# Altium project MC6205_Altium.PrjPcb (part 1 of 2)
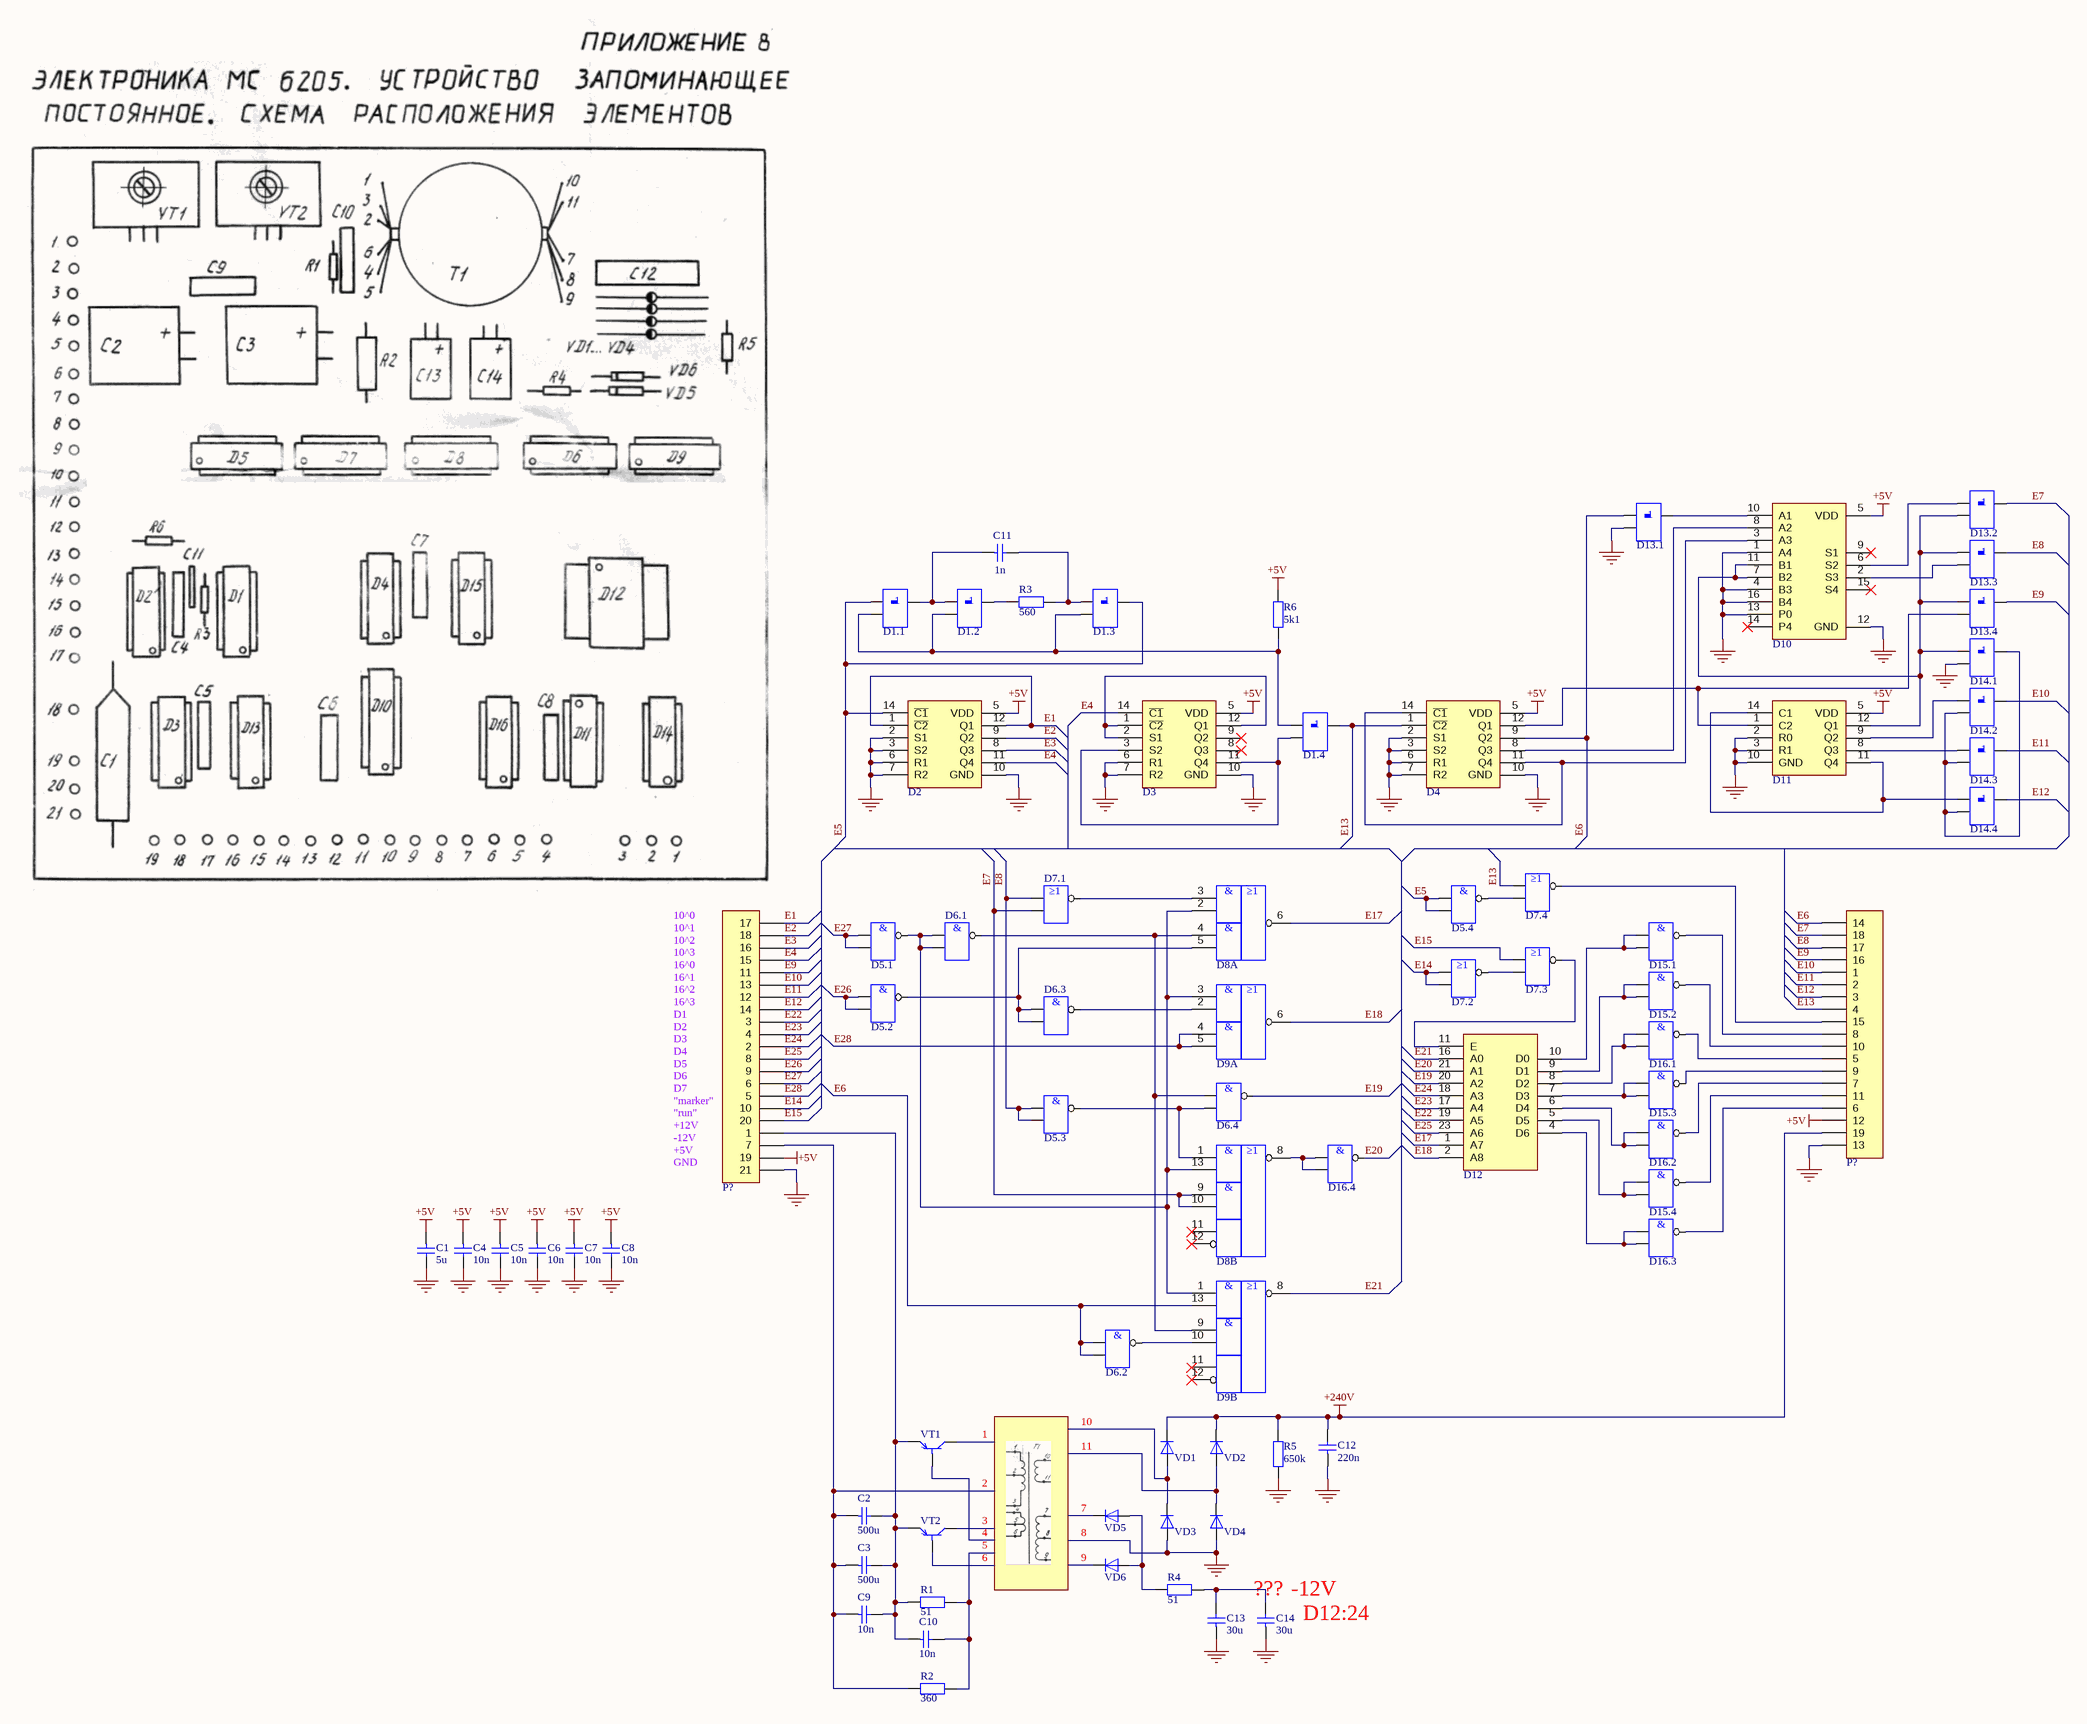
[diagram p0: Permanent_Storage.SchDoc]
4 sheets, 443 parts. Net scope: global (net labels, ports and power ports of the same name join across sheets).
Sheets:
  Permanent_Storage.SchDoc
  Operational_Storage.SchDoc
  Display_Driver.SchDoc
  Cathode_Switch.SchDoc

## Sheet Permanent_Storage.SchDoc
size 594 x 420 mm; SheetNumber: 1; SheetTotal: 4

### Parts
(Parts that share a designator on the sheet are numbered #1, #2 ... from top to bottom, then left to right.)
C1#1  5u
C2#1  500u
C3#1  500u
C4#1  10n
C5#1  10n
C6#1  10n
C7#1  10n
C8  10n
C9  10n
C10  10n
C11  1n
C12  220n
C13  30u
C14  30u
D1.1#1  -  (value not drawn)
D1.2#1  -  (value not drawn)
D1.3#1  -  (value not drawn)
D1.4#1  -  (value not drawn)
D2#1  -  (value not drawn)
D3#1  -  (value not drawn)
D4#1  -  (value not drawn)
D5.1  -  (value not drawn)
D5.2  -  (value not drawn)
D5.3  -  (value not drawn)
D5.4  -  (value not drawn)
D6.1  -  (value not drawn)
D6.2  -  (value not drawn)
D6.3  -  (value not drawn)
D6.4  -  (value not drawn)
D7.1  -  (value not drawn)
D7.2  -  (value not drawn)
D7.3  -  (value not drawn)
D7.4  -  (value not drawn)
D8#1  -  (value not drawn)  (parts A,B of 3)
D9#1  -  (value not drawn)  (parts A,B of 3)
D10#1  -  (value not drawn)
D11#1  -  (value not drawn)
D12#1  -  (value not drawn)
D13.1  -  (value not drawn)
D13.2  -  (value not drawn)
D13.3  -  (value not drawn)
D13.4  -  (value not drawn)
D14.1  -  (value not drawn)
D14.2  -  (value not drawn)
D14.3  -  (value not drawn)
D14.4  -  (value not drawn)
D15.1  -  (value not drawn)
D15.2  -  (value not drawn)
D15.3  -  (value not drawn)
D15.4  -  (value not drawn)
D16.1  -  (value not drawn)
D16.2  -  (value not drawn)
D16.3  -  (value not drawn)
D16.4  -  (value not drawn)
P?#1  -  (value not drawn)
P?#2  -  (value not drawn)
R1#1  51
R2#1  360
R3#1  560
R4#1  51
R5#1  650k
R6#1  5k1
VD1  -  (value not drawn)
VD2  -  (value not drawn)
VD3  -  (value not drawn)
VD4  -  (value not drawn)
VD5  -  (value not drawn)
VD6  -  (value not drawn)
VT1  -  (value not drawn)
VT2  -  (value not drawn)

### Nets
+5V: C1#1.2 C4#1.2 C5#1.2 C6#1.2 C7#1.2 C8.2 D2#1.5(VDD) D3#1.5(VDD) D4#1.5(VDD) D10#1.5(VDD) D11#1.5(VDD) P?#1.19 P?#2.12 R6#1.2
+240V: C12.1 P?#2.19 R5#1.2 VD1.1 VD2.1
GND: C1#1.1 C4#1.1 C5#1.1 C6#1.1 C7#1.1 C8.1 C12.2 C13.2 C14.2 D2#1.2(S1) D2#1.3(S2) D2#1.6(R1) D2#1.7(R2) D2#1.10(GND) D3#1.6(R1) D3#1.7(R2) D3#1.10(GND) D4#1.2(S1) D4#1.3(S2) D4#1.6(R1) D4#1.7(R2) D4#1.10(GND) D10#1.1(A4) D10#1.4(B3) D10#1.12(GND) D10#1.13(P0) D10#1.16(B4) D11#1.2(R0) D11#1.3(R1) D11#1.10(GND) D13.1.3(B1) D14.1.3(B1) P?#1.21 P?#2.13 R5#1.1 VD3.2 VD4.2
E1: D2#1.1(~{C2}) D2#1.12(Q1) P?#1.17
E2: D2#1.9(Q2) P?#1.18
E3: D2#1.8(Q3) P?#1.16
E4: D2#1.11(Q4) D3#1.14(~{C1}) P?#1.15
E5: D1.1#1.2(A1) D1.3#1.1(Y1) D2#1.14(~{C1}) D5.4.1 D5.4.2
E6: D4#1.9(Q2) D6.2.1 D6.2.2 D9#1.13(X6) D13.1.2(A1) P?#2.14
E7: D7.1.2 D8#1.9(X7) D8#1.10(X8) D13.2.1(Y1) P?#2.18
E8: D5.3.1 D5.3.2 D7.1.1 D13.3.1(Y1) P?#2.17
E9: D13.4.1(Y1) P?#1.11 P?#2.16
E10: D14.2.1(Y1) P?#1.13 P?#2.1
E11: D14.3.1(Y1) P?#1.12 P?#2.2
E12: D14.4.1(Y1) P?#1.14 P?#2.3
E13: D1.4#1.1(Y1) D4#1.1(~{C2}) D7.4.1 P?#2.4
E14: D7.2.1 D7.2.2 P?#1.10
E15: D7.3.1 P?#1.20
E17: D8#1.6(Y1) D12#1.1(A7)
E18: D9#1.6(Y1) D12#1.2(A8)
E19: D6.4.3 D12#1.20(A2)
E20: D12#1.21(A1) D16.4.3
E21: D9#1.8(Y2) D12#1.16(A0)
E22: D12#1.19(A5) P?#1.3
E23: D12#1.17(A4) P?#1.4
E24: D12#1.18(A3) P?#1.2
E25: D12#1.23(A6) P?#1.8
E26: D5.2.1 D5.2.2 P?#1.9
E27: D5.1.1 D5.1.2 P?#1.6
E28: D9#1.4(X3) D9#1.5(X4) P?#1.5
NetC2#1_1: C2#1.1 C3#1.1 C9.1 C10.2 P?#1.1 R1#1.1 VT1.2 VT2.2
NetC2#1_2: C2#1.2 C3#1.2 C9.2 P?#1.7 R2#1.1
NetC10_1: C10.1 R1#1.2 R2#1.2
NetC11_1: C11.1 D1.3#1.2(A1) R3#1.2
NetC11_2: C11.2 D1.1#1.1(Y1) D1.2#1.2(A1)
NetC13_1: C13.1 C14.1 R4#1.1
NetD1.1#1_3: D1.1#1.3(B1) D1.2#1.3(B1) D1.3#1.3(B1) D1.4#1.2(A1) R6#1.1
NetD1.2#1_1: D1.2#1.1(Y1) R3#1.1
NetD1.4#1_3: D1.4#1.3(B1) D3#1.3(S2) D3#1.11(Q4)
NetD3#1_1: D3#1.1(~{C2}) D3#1.2(S1) D3#1.12(Q1)
NetD4#1_8: D4#1.8(Q3) D10#1.8(A2)
NetD4#1_11: D4#1.11(Q4) D4#1.14(~{C1}) D10#1.3(A3)
NetD4#1_12: D4#1.12(Q1) D11#1.1(C2) D13.4.3(B1)
NetD5.1_3: D5.1.3 D6.1.1 D6.1.2 D8#1.2(X1) D8#1.13(X6) D9#1.1(X5) D9#1.3(X2)
NetD5.2_3: D5.2.3 D6.3.1 D6.3.2 D8#1.5(X4)
NetD5.3_3: D5.3.3 D6.4.2 D8#1.1(X5)
NetD5.4_3: D5.4.3 D7.4.2
NetD6.1_3: D6.1.3 D6.4.1 D8#1.4(X3) D9#1.9(X7)
NetD6.2_3: D6.2.3 D9#1.10(X8)
NetD6.3_3: D6.3.3 D9#1.2(X1)
NetD7.1_3: D7.1.3 D8#1.3(X2)
NetD7.2_3: D7.2.3 D7.3.2
NetD7.3_3: D7.3.3 D12#1.11(E)
NetD7.4_3: D7.4.3 P?#2.15
NetD8#1_8: D8#1.8(Y2) D16.4.1 D16.4.2
NetD10#1_2: D10#1.2(S3) D13.3.3(B1)
NetD10#1_6: D10#1.6(S2) D13.2.2(A1)
NetD10#1_7: D10#1.7(B2) D10#1.11(B1) D11#1.12(Q1) D13.2.3(B1) D13.3.2(A1) D13.4.2(A1) D14.1.2(A1)
NetD10#1_10: D10#1.10(A1) D13.1.1(Y1)
NetD11#1_8: D11#1.8(Q3) D14.3.2(A1)
NetD11#1_9: D11#1.9(Q2) D14.2.2(A1)
NetD11#1_11: D11#1.11(Q4) D11#1.14(C1) D14.4.2(A1)
NetD12#1_4: D12#1.4(D6) D16.3.1 D16.3.2
NetD12#1_5: D12#1.5(D5) D15.4.1 D15.4.2
NetD12#1_6: D12#1.6(D4) D16.2.1 D16.2.2
NetD12#1_7: D12#1.7(D3) D15.3.1 D15.3.2
NetD12#1_8: D12#1.8(D2) D16.1.1 D16.1.2
NetD12#1_9: D12#1.9(D1) D15.2.1 D15.2.2
NetD12#1_10: D12#1.10(D0) D15.1.1 D15.1.2
NetD14.1_1: D14.1.1(Y1) D14.2.3(B1) D14.3.3(B1) D14.4.3(B1)
NetD15.1_3: D15.1.3 P?#2.8
NetD15.2_3: D15.2.3 P?#2.10
NetD15.3_3: D15.3.3 P?#2.9
NetD15.4_3: D15.4.3 P?#2.11
NetD16.1_3: D16.1.3 P?#2.5
NetD16.2_3: D16.2.3 P?#2.7
NetD16.3_3: D16.3.3 P?#2.6
NetR4#1_2: R4#1.2 VD5.2 VD6.2
NetVD1_2: VD1.2 VD3.1
NetVD2_2: VD2.2 VD4.1

Not connected (* = marked no-connect by the designer): D3#1 8(Q3)* 9(Q2)*; D8#1 11(X9)* 12(X10)*; D9#1 11(X9)* 12(X10)*; D10#1 9(S1)* 14(P4)* 15(S4)*; VD5 1; VD6 1; VT1 1 3; VT2 1 3

### Notes on the sheet
- 10^0
- 10^1
- 16^0
- 16^1
- 16^2
- 10^2
- 10^3
- D1
- D2
- D3
- D4
- 16^3
- D5
- D6
- D7
- (near P?#1) "marker"
- "run"
- GND
- +12V
- -12V
- +5V
- 10
- (near VT1) 1
- 2
- 11
- (near VT2) 3
- (near VT2) 4
- (near VT2) 5
- (near VD5) 7
- 8
- 6
- (near VD6) 9
- (near C14) ???
- (near C14) -12V
- (near C14) D12:24
- DWG NO:
- REV:
- REVISION
- DESCRIPTION
- DATE
- APPROVED
- ENG:
- APPROVALS
- PROJECT
- DSN:
- CHK:
- REFERENCE DOCUMENTS
- PROJECT REVISION:
- TITLE
- DOCUMENT REVISION:
- DESIGN ITEM:
- BOM:
- FAB DWG:
- PCB DWG:
- ASSY DWG:
- SCALE:
- A2
- SIZE
- CAGE CODE
- FILE NAME
- DWG NO.
- SHEET
- OF
- REV
- (in symbol NAND) &
- (in symbol NOR) ≥1
- (in symbol К155ЛР1, part A) &; ≥1
- (in symbol К155ЛР1, part B) &; ≥1

### Library data of the parts
C1#1 C2#1 C3#1 C4#1 C5#1 C6#1 C7#1 C8-C14 = C
D1.1#1 D1.2#1 D1.3#1 D1.4#1 D13.1-D13.4 D14.1-D14.4 = XOR
D2#1 D3#1 D4#1 = К155ИЕ2: four digit decimal counter - https://kiloom.ru/spravochnik-radiodetalej/microsxema/k155ie2-km155ie2.html https://www.microshemca.ru/IE2/
D5.1-D5.4 D6.1-D6.4 D15.1-D15.4 D16.1-D16.4 = NAND
D7.1-D7.4 = NOR
D8#1 D9#1 = К155ЛР1: 2x 2x AND to 1x NOR - https://kiloom.ru/spravochnik-radiodetalej/microsxema/k155lr1-km155lr1-kb155lr1-4.html
D10#1 = К155ИМ3: 4-bit full adder - https://kiloom.ru/spravochnik-radiodetalej/microsxema/k155im3-km155im3.html
D11#1 = К155ИЕ5: binary counter - https://kiloom.ru/spravochnik-radiodetalej/microsxema/k155ie5-km155ie5.html
D12#1 = КР505РЕ3: some sort of ROM
P?#1 = 21x1_Connector_b
P?#2 = 19x1_Connector
R1#1 R2#1 R3#1 R4#1 R5#1 R6#1 = R
VD1-VD6 = D
VT1 VT2 = NPN

## Sheet Operational_Storage.SchDoc
size 594 x 420 mm; SheetNumber: 2; SheetTotal: 4
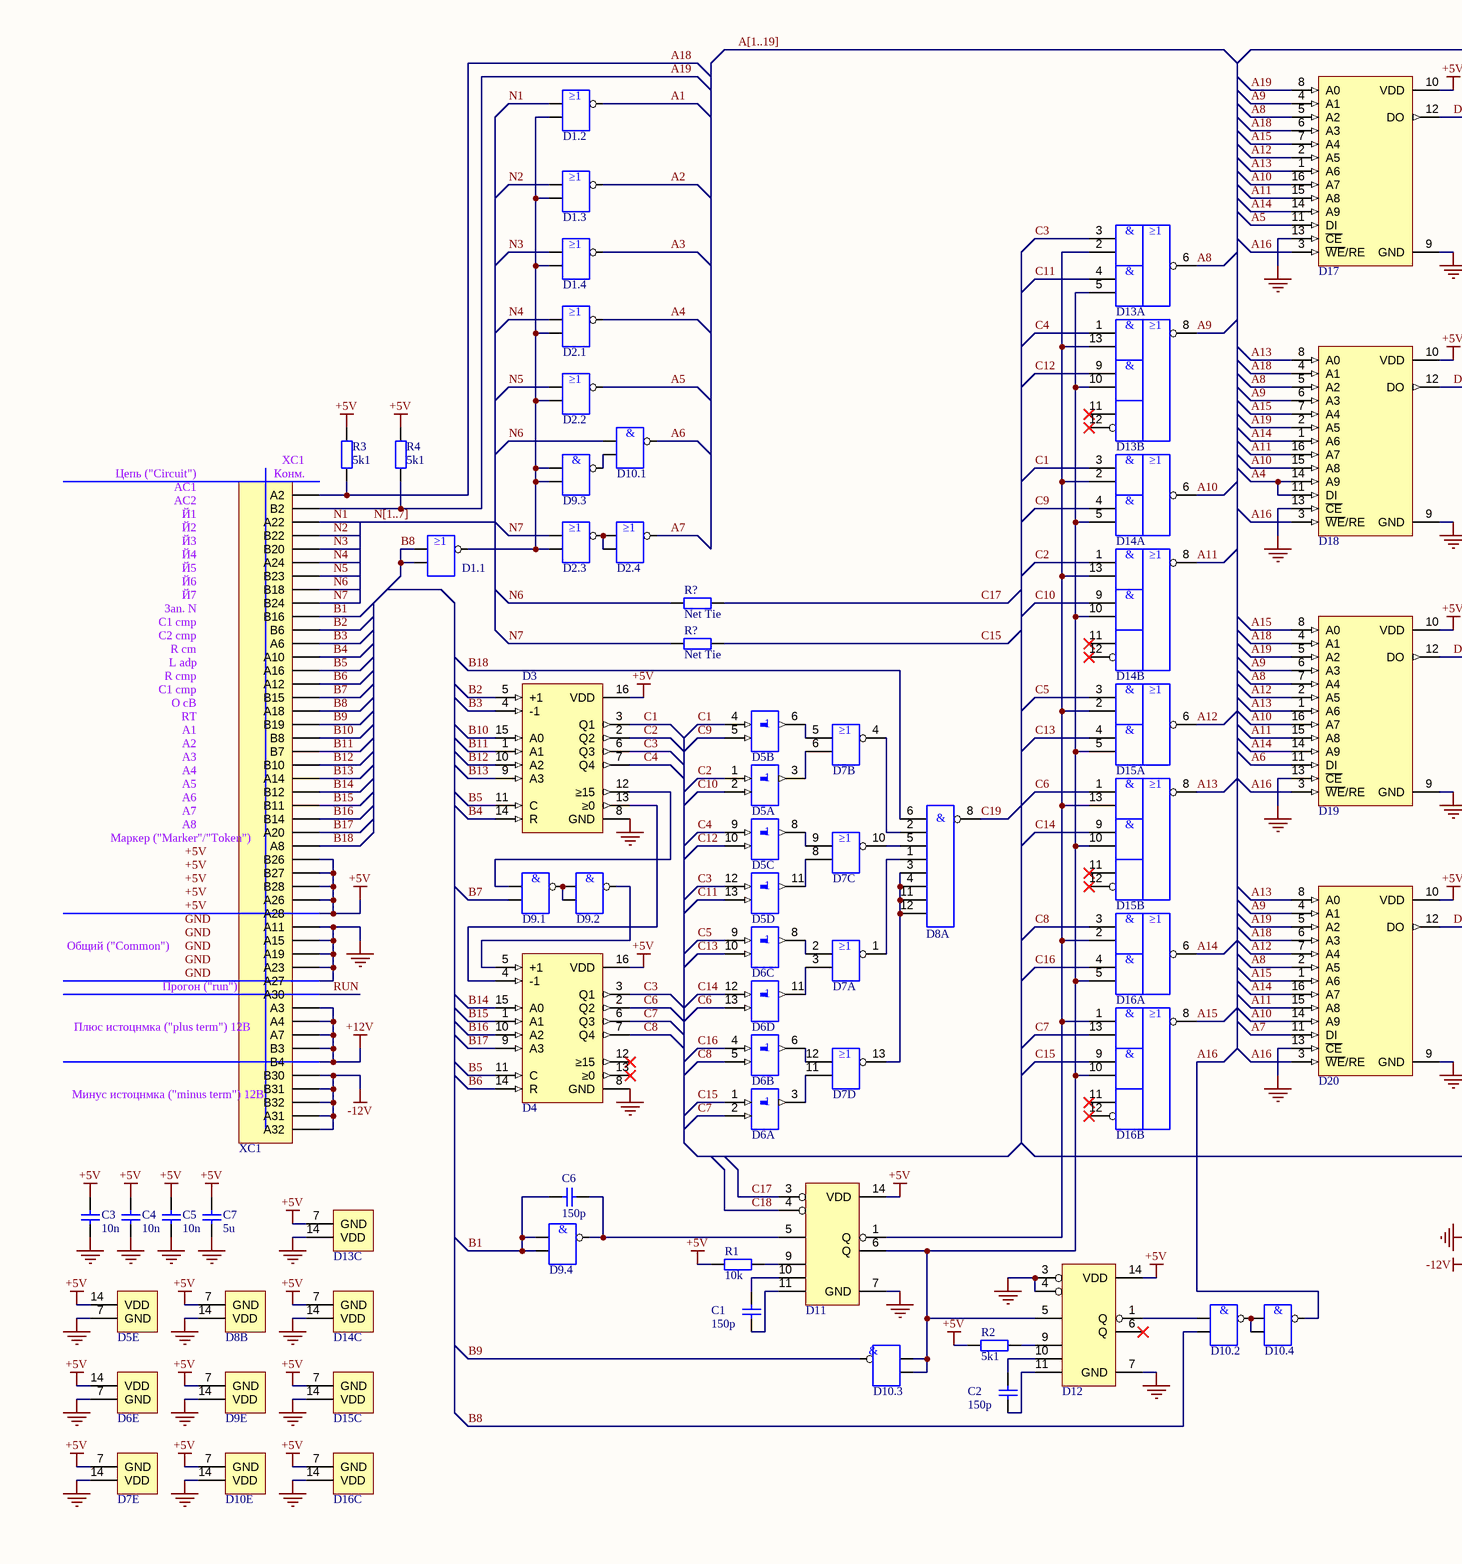
[diagram p1: Operational_Storage.SchDoc, left]
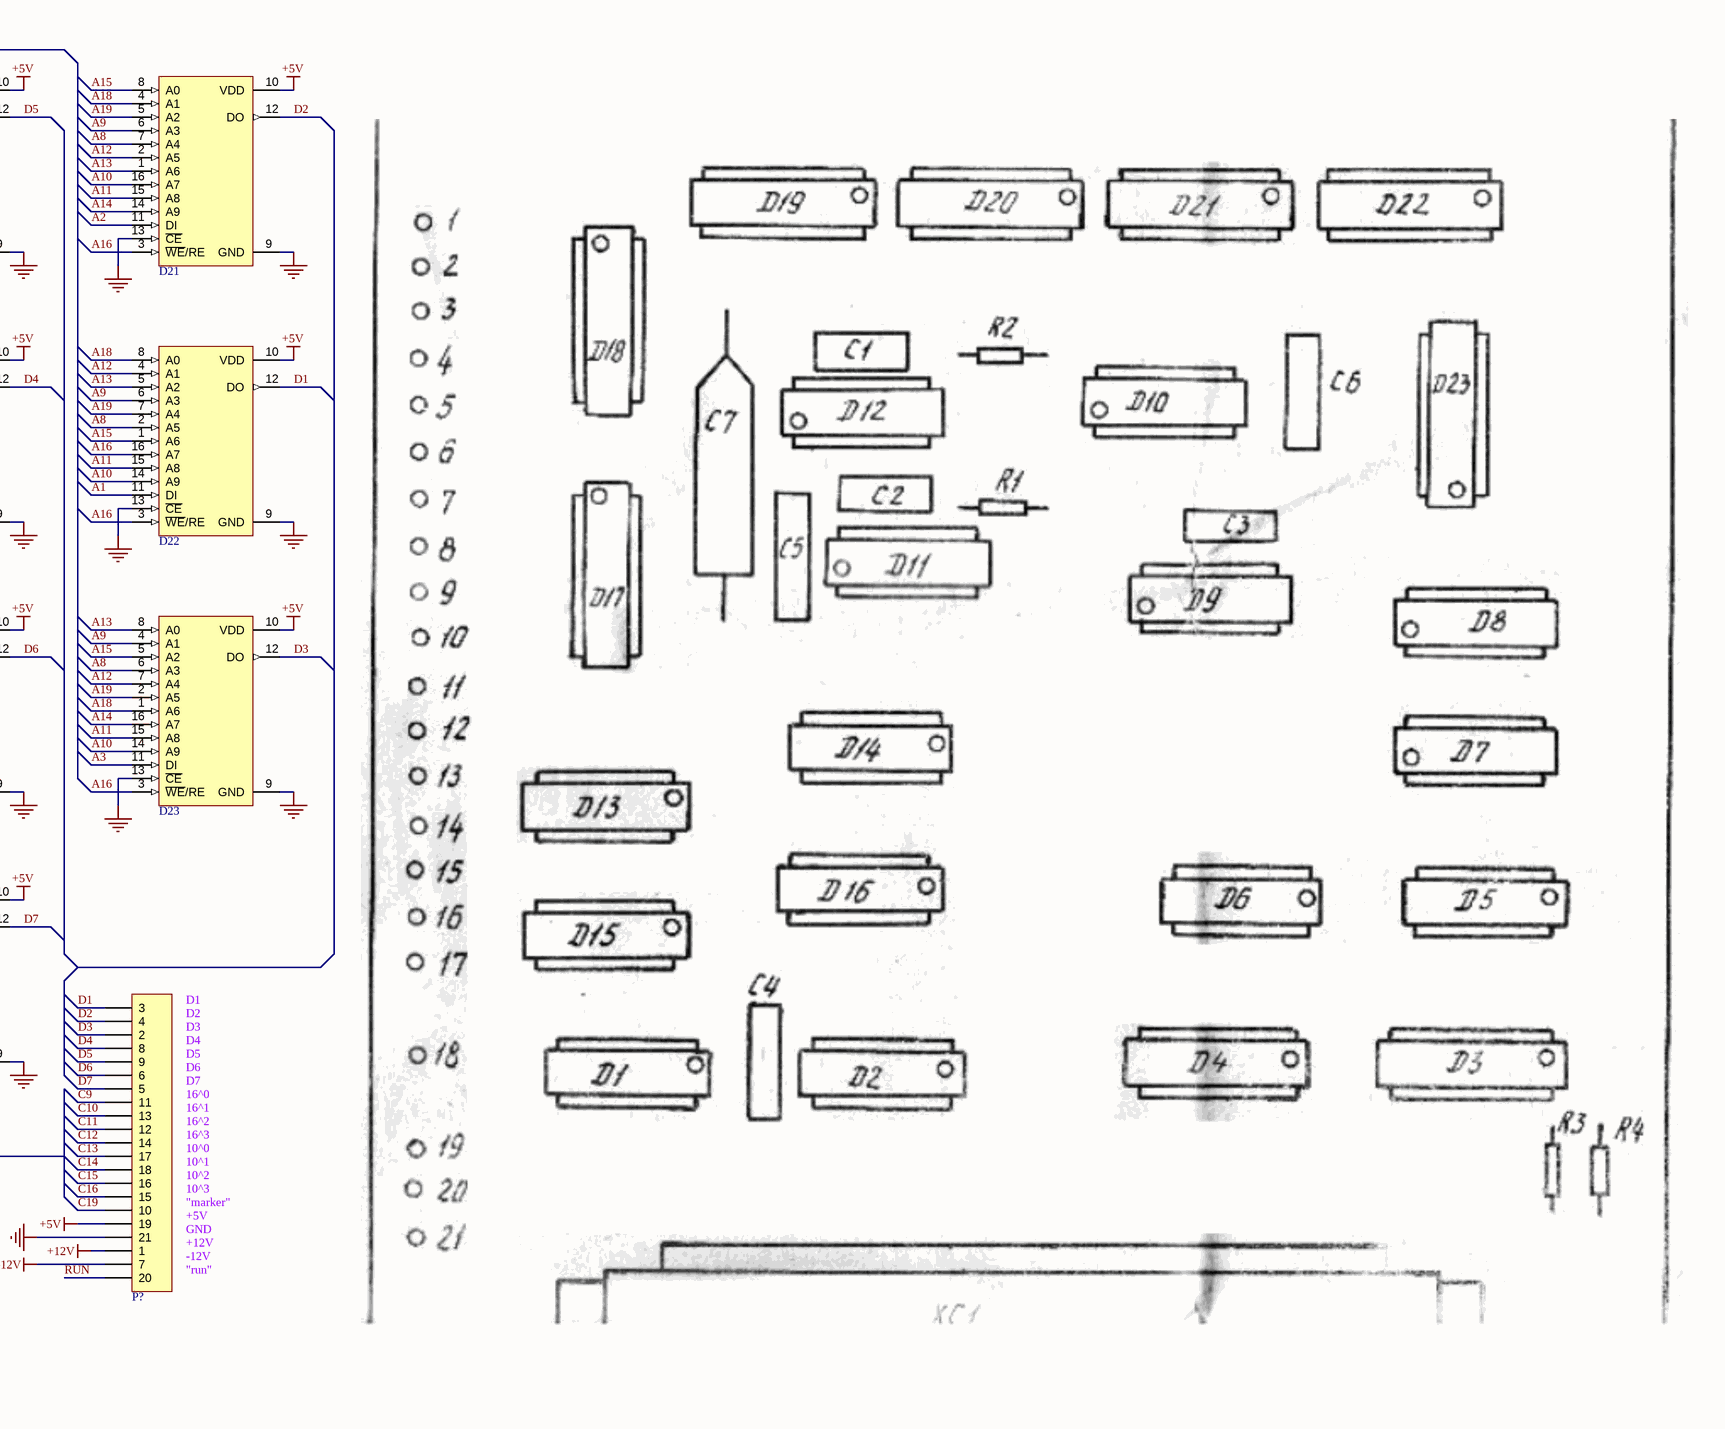
[diagram p2: Operational_Storage.SchDoc, right]

### Parts
(Parts that share a designator on the sheet are numbered #1, #2 ... from top to bottom, then left to right.)
C1#2  150p
C2#2  150p
C3#2  10n
C4#2  10n
C5#2  10n
C6#2  150p
C7#2  5u
D1.1#2  -  (value not drawn)
D1.2#2  -  (value not drawn)
D1.3#2  -  (value not drawn)
D1.4#2  -  (value not drawn)
D2.1#1  -  (value not drawn)
D2.2#1  -  (value not drawn)
D2.3  -  (value not drawn)
D2.4#1  -  (value not drawn)
D3#2  -  (value not drawn)
D4#2  -  (value not drawn)
D5#1  -  (value not drawn)  (parts A,B,C,D,E of 5)
D6#1  -  (value not drawn)  (parts A,B,C,D,E of 5)
D7#1  -  (value not drawn)  (parts A,B,C,D,E of 5)
D8#2  -  (value not drawn)  (parts A,B of 2)
D9#2  -  (value not drawn)  (part E of 5)
D9.1  -  (value not drawn)
D9.2  -  (value not drawn)
D9.3  -  (value not drawn)
D9.4  -  (value not drawn)
D10#2  -  (value not drawn)  (part E of 5)
D10.1  -  (value not drawn)
D10.2  -  (value not drawn)
D10.3  -  (value not drawn)
D10.4  -  (value not drawn)
D11#2  -  (value not drawn)
D12#2  -  (value not drawn)
D13#1  -  (value not drawn)  (parts A,B,C of 3)
D14#1  -  (value not drawn)  (parts A,B,C of 3)
D15#1  -  (value not drawn)  (parts A,B,C of 3)
D16#1  -  (value not drawn)  (parts A,B,C of 3)
D17#1  -  (value not drawn)
D18#1  -  (value not drawn)
D19#1  -  (value not drawn)
D20#1  -  (value not drawn)
D21#1  -  (value not drawn)
D22#1  -  (value not drawn)
D23#1  -  (value not drawn)
P?#3  -  (value not drawn)
R1#2  10k
R2#2  5k1
R3#2  5k1
R4#2  5k1
R?#1  Net Tie
R?#2  Net Tie
XC1  -  (value not drawn)

### Nets
+5V: C3#2.2 C4#2.2 C5#2.2 C7#2.2 D3#2.16(VDD) D4#2.16(VDD) D5#1.14(VDD) D6#1.14(VDD) D7#1.7(GND) D8#2.7(GND) D9#2.7(GND) D10#2.7(GND) D11#2.14(VDD) D12#2.14(VDD) D13#1.7(GND) D14#1.7(GND) D15#1.7(GND) D16#1.7(GND) D17#1.10(VDD) D18#1.10(VDD) D19#1.10(VDD) D20#1.10(VDD) D21#1.10(VDD) D22#1.10(VDD) D23#1.10(VDD) P?#3.19 R1#2.1 R2#2.1 R3#2.2 R4#2.2 XC1.A26 XC1.A28 XC1.B26 XC1.B27 XC1.B28
+12V: P?#3.1 XC1.A3 XC1.A4 XC1.A7 XC1.B3 XC1.B4
-12V: P?#3.7 XC1.A31 XC1.A32 XC1.B30 XC1.B31 XC1.B32
GND: C3#2.1 C4#2.1 C5#2.1 C7#2.1 D3#2.8(GND) D4#2.8(GND) D5#1.7(GND) D6#1.7(GND) D7#1.14(VDD) D8#2.14(VDD) D9#2.14(VDD) D10#2.14(VDD) D11#2.7(GND) D12#2.3(A1) D12#2.4(A2) D12#2.7(GND) D13#1.14(VDD) D14#1.14(VDD) D15#1.14(VDD) D16#1.14(VDD) D17#1.9(GND) D17#1.13(~{CE}) D18#1.9(GND) D18#1.13(~{CE}) D19#1.9(GND) D19#1.13(~{CE}) D20#1.9(GND) D20#1.13(~{CE}) D21#1.9(GND) D21#1.13(~{CE}) D22#1.9(GND) D22#1.13(~{CE}) D23#1.9(GND) D23#1.13(~{CE}) P?#3.21 XC1.A11 XC1.A15 XC1.A19 XC1.A23 XC1.A27
A1: D1.2#2.3 D22#1.11(DI)
A2: D1.3#2.3 D21#1.11(DI)
A3: D1.4#2.3 D23#1.11(DI)
A4: D2.1#1.3 D18#1.11(DI) D18#1.14(A9)
A5: D2.2#1.3 D17#1.11(DI)
A6: D10.1.3 D19#1.11(DI)
A7: D2.4#1.3 D20#1.11(DI)
A8: D13#1.6(Y1) D17#1.5(A2) D18#1.5(A2) D19#1.7(A4) D20#1.2(A5) D21#1.7(A4) D22#1.2(A5) D23#1.6(A3)
A9: D13#1.8(Y2) D17#1.4(A1) D18#1.6(A3) D19#1.6(A3) D20#1.4(A1) D21#1.6(A3) D22#1.6(A3) D23#1.4(A1)
A10: D14#1.6(Y1) D17#1.16(A7) D18#1.15(A8) D19#1.16(A7) D20#1.14(A9) D21#1.16(A7) D22#1.14(A9) D23#1.14(A9)
A11: D14#1.8(Y2) D17#1.15(A8) D18#1.16(A7) D19#1.15(A8) D20#1.15(A8) D21#1.15(A8) D22#1.15(A8) D23#1.15(A8)
A12: D15#1.6(Y1) D17#1.2(A5) D19#1.2(A5) D20#1.7(A4) D21#1.2(A5) D22#1.4(A1) D23#1.7(A4)
A13: D15#1.8(Y2) D17#1.1(A6) D18#1.8(A0) D19#1.1(A6) D20#1.8(A0) D21#1.1(A6) D22#1.5(A2) D23#1.8(A0)
A14: D16#1.6(Y1) D17#1.14(A9) D18#1.1(A6) D19#1.14(A9) D20#1.16(A7) D21#1.14(A9) D23#1.16(A7)
A15: D16#1.8(Y2) D17#1.7(A4) D18#1.7(A4) D19#1.8(A0) D20#1.1(A6) D21#1.8(A0) D22#1.1(A6) D23#1.5(A2)
A16: D10.4.3 D17#1.3(~{WE}/RE) D18#1.3(~{WE}/RE) D19#1.3(~{WE}/RE) D20#1.3(~{WE}/RE) D21#1.3(~{WE}/RE) D22#1.3(~{WE}/RE) D22#1.16(A7) D23#1.3(~{WE}/RE)
A18: D17#1.6(A3) D18#1.4(A1) D19#1.4(A1) D20#1.6(A3) D21#1.4(A1) D22#1.8(A0) D23#1.1(A6) R3#2.1 XC1.A2
A19: D17#1.8(A0) D18#1.2(A5) D19#1.5(A2) D20#1.5(A2) D21#1.5(A2) D22#1.7(A4) D23#1.2(A5) R4#2.1 XC1.B2
B1: C6#2.1 D9.4.1 D9.4.2 XC1.B16
B2: D3#2.5(+1) XC1.B6
B3: D3#2.4(-1) XC1.A6
B4: D3#2.14(R) XC1.A10
B5: D3#2.11(C) D4#2.11(C) XC1.A16
B6: D4#2.14(R) XC1.A12
B7: D9.1.2 XC1.B15
B8: D1.1#2.1 D1.1#2.2 D10.2.2 XC1.A18
B9: D10.3.3 XC1.B19
B10: D3#2.15(A0) XC1.B8
B11: D3#2.1(A1) XC1.B7
B12: D3#2.10(A2) XC1.B10
B13: D3#2.9(A3) XC1.A14
B14: D4#2.15(A0) XC1.B12
B15: D4#2.1(A1) XC1.B11
B16: D4#2.10(A2) XC1.B14
B17: D4#2.9(A3) XC1.A20
B18: D8#2.6(X6) XC1.A8
C1: D3#2.3(Q1) D5#1.4(A2) D14#1.3(X2)
C2: D3#2.2(Q2) D5#1.1(A1) D14#1.1(X5)
C3: D3#2.6(Q3) D4#2.3(Q1) D5#1.12(A4) D13#1.3(X2)
C4: D3#2.7(Q4) D5#1.9(A3) D13#1.1(X5)
C5: D6#1.9(A3) D15#1.3(X2)
C6: D4#2.2(Q2) D6#1.13(B4) D15#1.1(X5)
C7: D4#2.6(Q3) D6#1.2(B1) D16#1.13(X6)
C8: D4#2.7(Q4) D6#1.5(B2) D16#1.3(X2)
C9: D5#1.5(B2) D14#1.4(X3) P?#3.11
C10: D5#1.2(B1) D14#1.9(X7) P?#3.13
C11: D5#1.13(B4) D13#1.4(X3) P?#3.12
C12: D5#1.10(B3) D13#1.9(X7) P?#3.14
C13: D6#1.10(B3) D15#1.4(X3) P?#3.17
C14: D6#1.12(A4) D15#1.9(X7) P?#3.18
C15: D6#1.1(A1) D16#1.9(X7) P?#3.16 R?#2.1
C16: D6#1.4(A2) D16#1.4(X3) P?#3.15
C17: D11#2.3(A1) R?#1.1
C18: D11#2.4(A2)
C19: D8#2.8(Y) P?#3.10
D1: D22#1.12(DO) P?#3.3
D2: D21#1.12(DO) P?#3.4
D3: D23#1.12(DO) P?#3.2
D4: D18#1.12(DO) P?#3.8
D5: D17#1.12(DO) P?#3.9
D6: D19#1.12(DO) P?#3.6
D7: D20#1.12(DO) P?#3.5
N1: D1.2#2.1 XC1.A22
N2: D1.3#2.1 XC1.B22
N3: D1.4#2.1 XC1.B20
N4: D2.1#1.1 XC1.A24
N5: D2.2#1.1 XC1.B23
N6: D10.1.1 R?#1.2 XC1.B18
N7: D2.3.1 R?#2.2 XC1.B24
RUN: P?#3.20 XC1.A30
NetC1#2_1: C1#2.1 D11#2.11(RTCT)
NetC1#2_2: C1#2.2 D11#2.10(CT)
NetC2#2_1: C2#2.1 D12#2.11(RTCT)
NetC2#2_2: C2#2.2 D12#2.10(CT)
NetC6#2_2: C6#2.2 D9.4.3 D11#2.5(B)
NetD1.1#2_3: D1.1#2.3 D1.2#2.2 D1.3#2.2 D1.4#2.2 D2.1#1.2 D2.2#1.2 D2.3.2 D9.3.1 D9.3.2
NetD2.3_3: D2.3.3 D2.4#1.1 D2.4#1.2
NetD3#2_12: D3#2.12(≥15) D9.1.1
NetD3#2_13: D3#2.13(≥0) D4#2.4(-1)
NetD4#2_5: D4#2.5(+1) D9.2.3
NetD5#1_3: D5#1.3(Y1) D7#1.6(B2)
NetD5#1_6: D5#1.6(Y2) D7#1.5(A2)
NetD5#1_8: D5#1.8(Y3) D7#1.9(A3)
NetD5#1_11: D5#1.11(Y4) D7#1.8(B3)
NetD6#1_3: D6#1.3(Y1) D7#1.11(B4)
NetD6#1_6: D6#1.6(Y2) D7#1.12(A4)
NetD6#1_8: D6#1.8(Y3) D7#1.2(A1)
NetD6#1_11: D6#1.11(Y4) D7#1.3(B1)
NetD7#1_1: D7#1.1(Y1) D8#2.1(X1)
NetD7#1_4: D7#1.4(Y2) D8#2.2(X2)
NetD7#1_10: D7#1.10(Y3) D8#2.5(X5)
NetD7#1_13: D7#1.13(Y4) D8#2.3(X3) D8#2.4(X4) D8#2.11(X7) D8#2.12(X8)
NetD9.1_3: D9.1.3 D9.2.1 D9.2.2
NetD9.3_3: D9.3.3 D10.1.2
NetD10.2_1: D10.2.1 D12#2.1(Q)
NetD10.2_3: D10.2.3 D10.4.1 D10.4.2
NetD10.3_1: D10.3.1 D10.3.2 D11#2.6(Q) D12#2.5(B) D13#1.5(X4) D13#1.10(X8) D14#1.5(X4) D14#1.10(X8) D15#1.5(X4) D15#1.10(X8) D16#1.5(X4) D16#1.10(X8)
NetD11#2_1: D11#2.1(Q) D13#1.2(X1) D13#1.13(X6) D14#1.2(X1) D14#1.13(X6) D15#1.2(X1) D15#1.13(X6) D16#1.1(X5) D16#1.2(X1)
NetD11#2_9: D11#2.9(BBH) R1#2.2
NetD12#2_9: D12#2.9(BBH) R2#2.2

Not connected (* = marked no-connect by the designer): D4#2 12(≥15)* 13(≥0)*; D12#2 6(Q)*; D13#1 11(X9)* 12(X10)*; D14#1 11(X9)* 12(X10)*; D15#1 11(X9)* 12(X10)*; D16#1 11(X9)* 12(X10)*

### Buses and harness runs
bus A[1..19]
bus N[1..7]

### Notes on the sheet
- AC1
- AC2
- Цепь ("Circuit")
- XC1
- (near XC1) Конм.
- Й1
- Й2
- Й3
- Й4
- Й5
- 3an. N
- C1 cmp
- C2 cmp
- Й6
- Й7
- R cm
- L adp
- R cmp
- O cB
- RT
- A1
- A2
- A3
- A4
- A5
- A6
- A7
- A8
- (near XC1) Маркер ("Marker"/"Token")
- Общий ("Common")
- Прогон ("run")
- (near XC1) Плюс истоцнмка ("plus term") 12B
- D1
- D2
- D3
- D4
- (near XC1) Минус истоцнмка ("minus term") 12B
- D5
- D6
- D7
- 16^0
- 16^1
- 16^2
- 16^3
- 10^0
- 10^1
- 10^2
- 10^3
- +5V
- GND
- +12V
- "marker"
- "run"
- -12V
- Labels drawn without touching a wire or pin: +5V, GND
- DWG NO:
- REV:
- REVISION
- DESCRIPTION
- DATE
- APPROVED
- ENG:
- APPROVALS
- PROJECT
- DSN:
- CHK:
- REFERENCE DOCUMENTS
- PROJECT REVISION:
- TITLE
- DOCUMENT REVISION:
- DESIGN ITEM:
- BOM:
- FAB DWG:
- PCB DWG:
- ASSY DWG:
- SCALE:
- SIZE
- CAGE CODE
- FILE NAME
- DWG NO.
- SHEET
- OF
- REV
- (in symbol NAND) &
- (in symbol NOR) ≥1
- (in symbol К155ЛА2, part A) &
- (in symbol К155ЛЕ1, part A) ≥1
- (in symbol К155ЛЕ1, part B) ≥1
- (in symbol К155ЛЕ1, part C) ≥1
- (in symbol К155ЛЕ1, part D) ≥1
- (in symbol К155ЛР1, part A) &; ≥1
- (in symbol К155ЛР1, part B) &; ≥1

### Library data of the parts
C1#2 C2#2 C3#2 C4#2 C5#2 C6#2 C7#2 = C
D1.1#2 D1.2#2 D1.3#2 D1.4#2 D2.1#1 D2.2#1 D2.3 D2.4#1 = NOR
D3#2 D4#2 = K155IE7_counter_4bit_up/down: https://kiloom.ru/spravochnik-radiodetalej/microsxema/k155ie7-km155ie7.html
D5#1 D6#1 = К155ЛП5: https://kiloom.ru/spravochnik-radiodetalej/microsxema/k155lp5-km155lp5-kb155lp5-4.html
D7#1 = К155ЛЕ1: 4x 2 NOR - https://kiloom.ru/spravochnik-radiodetalej/microsxema/k155le1-km155le1.html
D8#2 = К155ЛА2: 8 input NOR - https://kiloom.ru/spravochnik-radiodetalej/microsxema/k155la2-km155la2-kb155la2-4.html
D9#2 D10#2 = К155ЛА3: 4x NAND - https://kiloom.ru/spravochnik-radiodetalej/microsxema/k155la3-km155la3-kb155la3-4.html
D9.1-D9.4 D10.1-D10.4 = NAND
D11#2 D12#2 = К155АГ1: Multi-vibrator - https://kiloom.ru/spravochnik-radiodetalej/microsxema/k155ag1.html https://www.microshemca.ru/AG1/
D13#1 D14#1 D15#1 D16#1 = К155ЛР1: as D8#1 on sheet Permanent_Storage
D17#1 D18#1 D19#1 D20#1 D21#1 D22#1 D23#1 = КР565РУ2: https://www.radiomuseum.org/tubes/tube_kr565ru2.html
P?#3 = 21x1_Connector
R1#2 R2#2 R3#2 R4#2 R?#1 R?#2 = R
XC1 = 32x2_Connector

## Sheet Display_Driver.SchDoc
size 594 x 420 mm; SheetNumber: 3; SheetTotal: 4
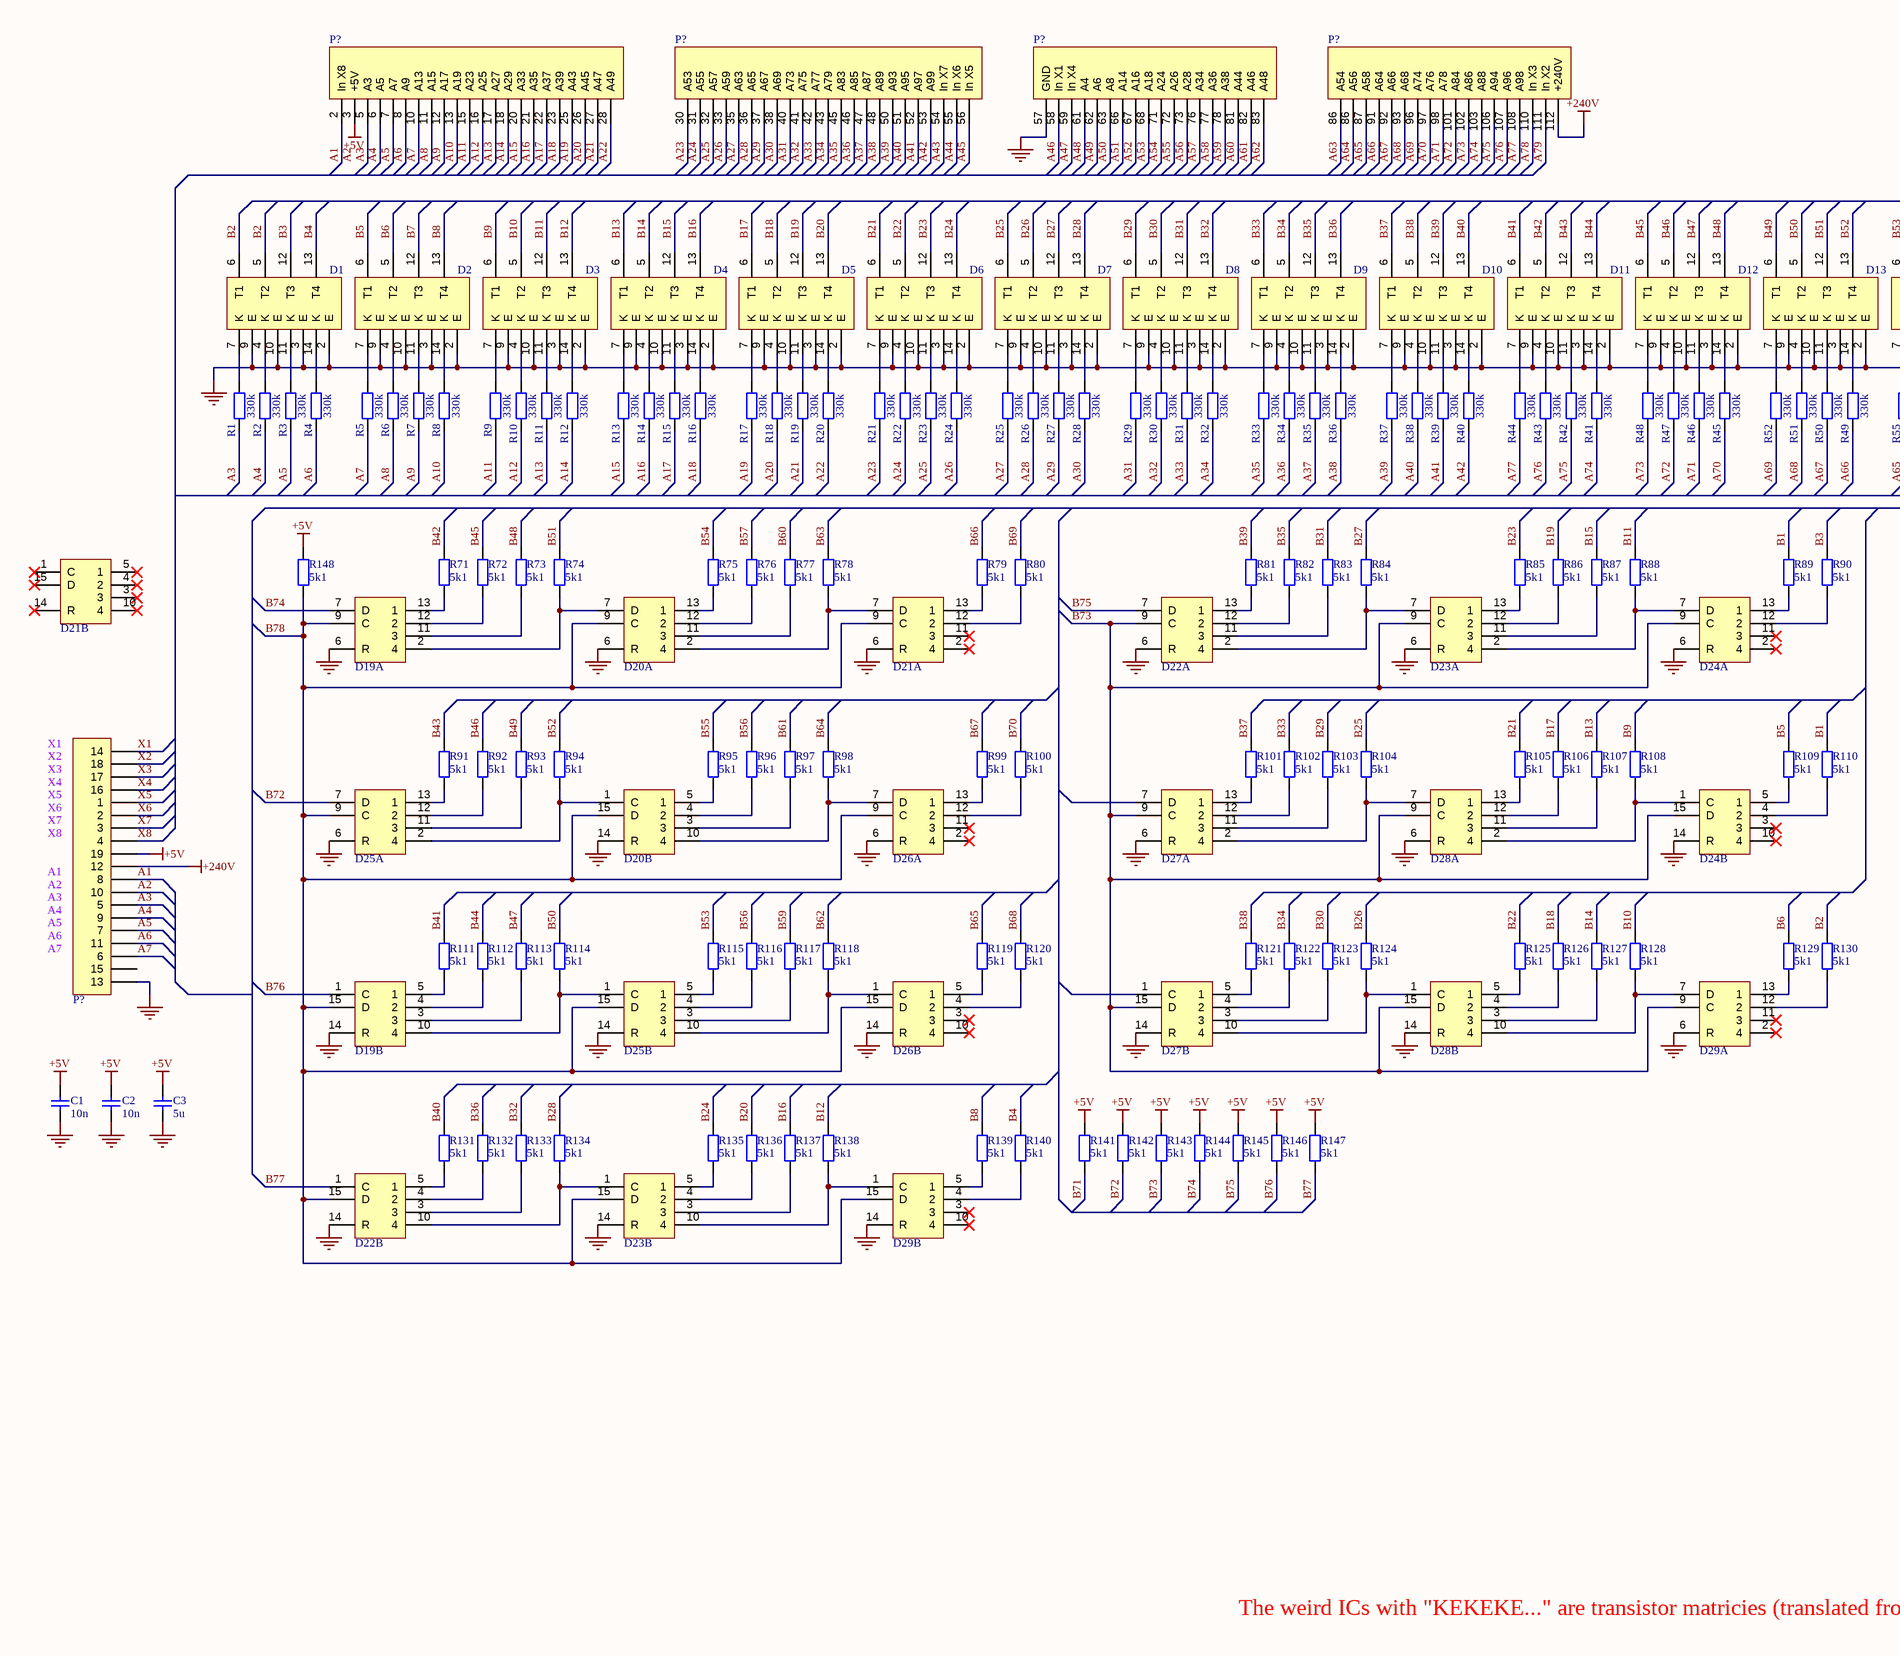
[diagram p3: Display_Driver.SchDoc, left]
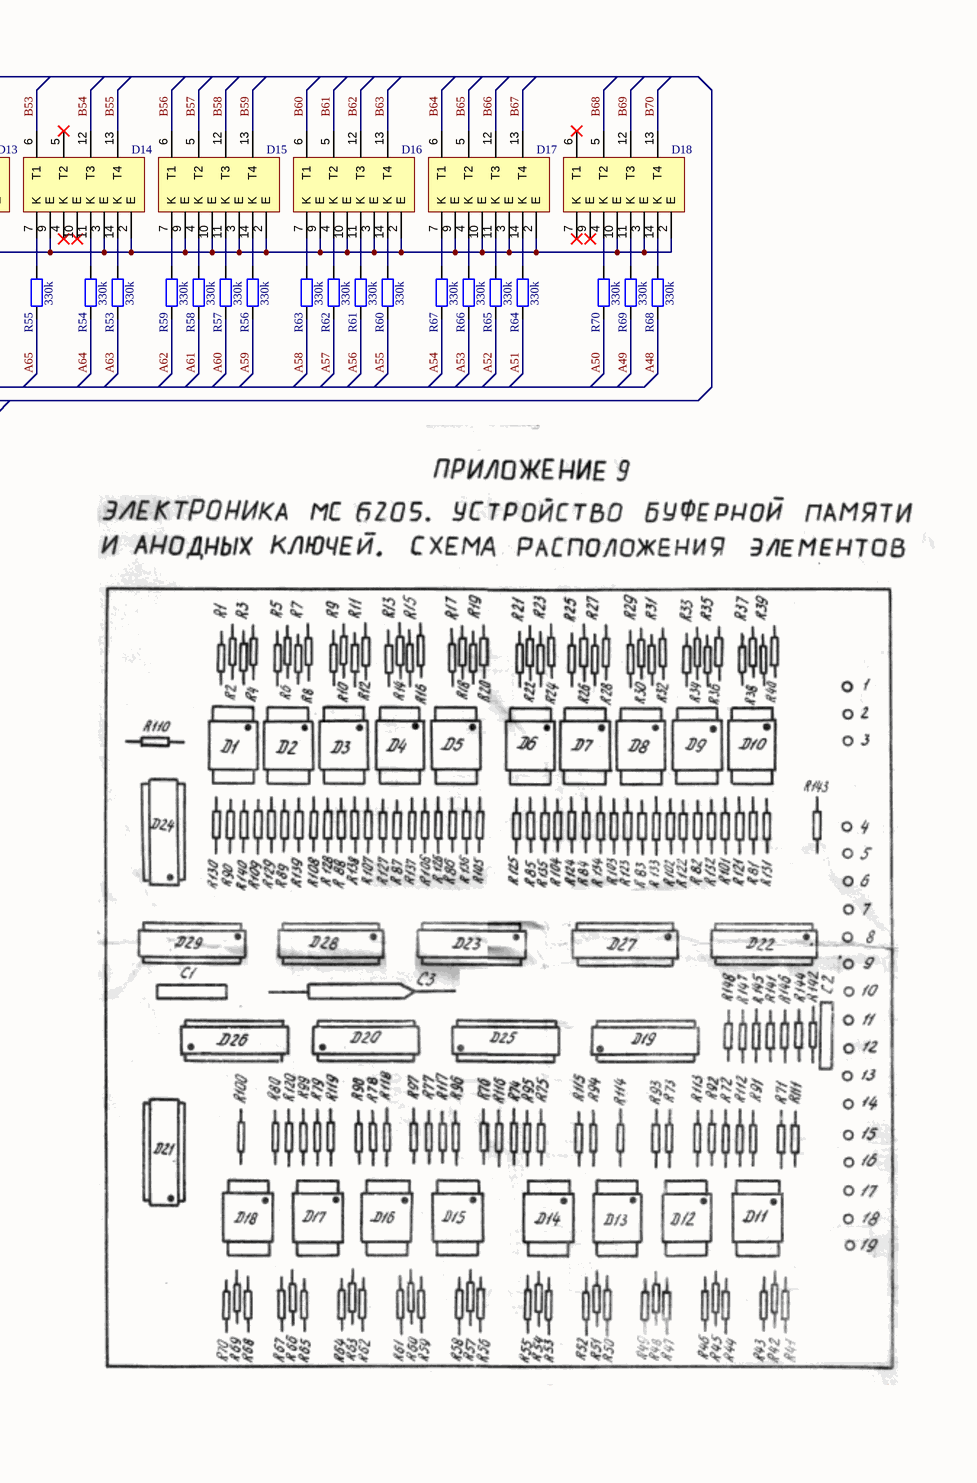
[diagram p4: Display_Driver.SchDoc, right]

### Parts
(Parts that share a designator on the sheet are numbered #1, #2 ... from top to bottom, then left to right.)
C1#3  10n
C2#3  10n
C3#3  5u
D1  -  (value not drawn)
D2#2  -  (value not drawn)
D3#3  -  (value not drawn)
D4#3  -  (value not drawn)
D5#2  -  (value not drawn)
D6#2  -  (value not drawn)
D7#2  -  (value not drawn)
D8#3  -  (value not drawn)
D9#3  -  (value not drawn)
D10#3  -  (value not drawn)
D11#3  -  (value not drawn)
D12#3  -  (value not drawn)
D13#2  -  (value not drawn)
D14#2  -  (value not drawn)
D15#2  -  (value not drawn)
D16#2  -  (value not drawn)
D17#2  -  (value not drawn)
D18#2  -  (value not drawn)
D19#2  -  (value not drawn)  (parts A,B of 2)
D20#2  -  (value not drawn)  (parts A,B of 2)
D21#2  -  (value not drawn)  (parts A,B of 2)
D22#2  -  (value not drawn)  (parts A,B of 2)
D23#2  -  (value not drawn)  (parts A,B of 2)
D24#1  -  (value not drawn)  (parts A,B of 2)
D25#1  -  (value not drawn)  (parts A,B of 2)
D26#1  -  (value not drawn)  (parts A,B of 2)
D27#1  -  (value not drawn)  (parts A,B of 2)
D28#1  -  (value not drawn)  (parts A,B of 2)
D29#1  -  (value not drawn)  (parts A,B of 2)
P?#4  -  (value not drawn)
P?#5  -  (value not drawn)
P?#6  -  (value not drawn)
P?#7  -  (value not drawn)
P?#8  -  (value not drawn)
R1#3  330k
R2#3  330k
R3#3  330k
R4#3  330k
R5#2  330k
R6#2  330k
R7#1  330k
R8#1  330k
R9#1  330k
R10#1  330k
R11#1  330k
R12#1  330k
R13#1  330k
R14#1  330k
R15#1  330k
R16#1  330k
R17#1  330k
R18#1  330k
R19#1  330k
R20#1  330k
R21#1  330k
R22#1  330k
R23#1  330k
R24#1  330k
R25#1  330k
R26#1  330k
R27#1  330k
R28#1  330k
R29#1  330k
R30#1  330k
R31#1  330k
R32#1  330k
R33#1  330k
R34#1  330k
R35#1  330k
R36#1  330k
R37#1  330k
R38#1  330k
R39#1  330k
R40#1  330k
R41#1  330k
R42#1  330k
R43#1  330k
R44#1  330k
R45#1  330k
R46#1  330k
R47#1  330k
R48#1  330k
R49#1  330k
R50#1  330k
R51#1  330k
R52#1  330k
R53#1  330k
R54#1  330k
R55#1  330k
R56#1  330k
R57#1  330k
R58#1  330k
R59#1  330k
R60#1  330k
R61#1  330k
R62#1  330k
R63#1  330k
R64#1  330k
R65#1  330k
R66#1  330k
R67#1  330k
R68#1  330k
R69#1  330k
R70#1  330k
R71#1  5k1
R72#1  5k1
R73#1  5k1
R74#1  5k1
R75#1  5k1
R76#1  5k1
R77#1  5k1
R78#1  5k1
R79#1  5k1
R80#1  5k1
R81#1  5k1
R82#1  5k1
R83#1  5k1
R84#1  5k1
R85#1  5k1
R86#1  5k1
R87#1  5k1
R88#1  5k1
R89#1  5k1
R90#1  5k1
R91#1  5k1
R92#1  5k1
R93#1  5k1
R94#1  5k1
R95#1  5k1
R96#1  5k1
R97#1  5k1
R98#1  5k1
R99#1  5k1
R100#1  5k1
R101  5k1
R102  5k1
R103  5k1
R104  5k1
R105  5k1
R106  5k1
R107  5k1
R108  5k1
R109  5k1
R110  5k1
R111  5k1
R112  5k1
R113  5k1
R114  5k1
R115  5k1
R116  5k1
R117  5k1
R118  5k1
R119  5k1
R120  5k1
R121  5k1
R122  5k1
R123  5k1
R124  5k1
R125  5k1
R126  5k1
R127  5k1
R128  5k1
R129  5k1
R130  5k1
R131  5k1
R132  5k1
R133  5k1
R134  5k1
R135  5k1
R136  5k1
R137  5k1
R138  5k1
R139  5k1
R140  5k1
R141  5k1
R142  5k1
R143  5k1
R144  5k1
R145  5k1
R146  5k1
R147  5k1
R148  5k1

### Nets
+5V: C1#3.1 C2#3.1 C3#3.1 P?#4.3(+5V) P?#8.19 R141.1 R142.1 R143.1 R144.1 R145.1 R146.1 R147.1 R148.2
+240V: P?#7.112(+240V) P?#8.12
GND: C1#3.2 C2#3.2 C3#3.2 D1.2(E) D1.3(E) D1.9(E) D1.10(E) D2#2.2(E) D2#2.3(E) D2#2.9(E) D2#2.10(E) D3#3.2(E) D3#3.3(E) D3#3.9(E) D3#3.10(E) D4#3.2(E) D4#3.3(E) D4#3.9(E) D4#3.10(E) D5#2.2(E) D5#2.3(E) D5#2.9(E) D5#2.10(E) D6#2.2(E) D6#2.3(E) D6#2.9(E) D6#2.10(E) D7#2.2(E) D7#2.3(E) D7#2.9(E) D7#2.10(E) D8#3.2(E) D8#3.3(E) D8#3.9(E) D8#3.10(E) D9#3.2(E) D9#3.3(E) D9#3.9(E) D9#3.10(E) D10#3.2(E) D10#3.3(E) D10#3.9(E) D10#3.10(E) D11#3.2(E) D11#3.3(E) D11#3.9(E) D11#3.10(E) D12#3.2(E) D12#3.3(E) D12#3.9(E) D12#3.10(E) D13#2.2(E) D13#2.3(E) D13#2.9(E) D13#2.10(E) D14#2.2(E) D14#2.3(E) D14#2.9(E) D15#2.2(E) D15#2.3(E) D15#2.9(E) D15#2.10(E) D16#2.2(E) D16#2.3(E) D16#2.9(E) D16#2.10(E) D17#2.2(E) D17#2.3(E) D17#2.9(E) D17#2.10(E) D18#2.2(E) D18#2.3(E) D18#2.10(E) D19#2.6(R) D19#2.14(R) D20#2.6(R) D20#2.14(R) D21#2.6(R) D22#2.6(R) D22#2.14(R) D23#2.6(R) D23#2.14(R) D24#1.6(R) D24#1.14(R) D25#1.6(R) D25#1.14(R) D26#1.6(R) D26#1.14(R) D27#1.6(R) D27#1.14(R) D28#1.6(R) D28#1.14(R) D29#1.6(R) D29#1.14(R) P?#6.57(GND) P?#8.13
A1: P?#4.2(In_X8) P?#8.8
A2: P?#8.10
A3: P?#4.5(A3) P?#8.5 R1#3.1
A4: P?#4.6(A5) P?#8.9 R2#3.1
A5: P?#4.7(A7) P?#8.7 R3#3.1
A6: P?#4.8(A9) P?#8.11 R4#3.1
A7: P?#4.10(A13) P?#8.6 R5#2.1
A8: P?#4.11(A15) R6#2.1
A9: P?#4.12(A17) R7#1.1
A10: P?#4.13(A19) R8#1.1
A11: P?#4.15(A23) R9#1.1
A12: P?#4.16(A25) R10#1.1
A13: P?#4.17(A27) R11#1.1
A14: P?#4.18(A29) R12#1.1
A15: P?#4.20(A33) R13#1.1
A16: P?#4.21(A35) R14#1.1
A17: P?#4.22(A37) R15#1.1
A18: P?#4.23(A39) R16#1.1
A19: P?#4.25(A43) R17#1.1
A20: P?#4.26(A45) R18#1.1
A21: P?#4.27(A47) R19#1.1
A22: P?#4.28(A49) R20#1.1
A23: P?#5.30(A53) R21#1.1
A24: P?#5.31(A55) R22#1.1
A25: P?#5.32(A57) R23#1.1
A26: P?#5.33(A59) R24#1.1
A27: P?#5.35(A63) R25#1.1
A28: P?#5.36(A65) R26#1.1
A29: P?#5.37(A67) R27#1.1
A30: P?#5.38(A69) R28#1.1
A31: P?#5.40(A73) R29#1.1
A32: P?#5.41(A75) R30#1.1
A33: P?#5.42(A77) R31#1.1
A34: P?#5.43(A79) R32#1.1
A35: P?#5.45(A83) R33#1.1
A36: P?#5.46(A85) R34#1.1
A37: P?#5.47(A87) R35#1.1
A38: P?#5.48(A89) R36#1.1
A39: P?#5.50(A93) R37#1.1
A40: P?#5.51(A95) R38#1.1
A41: P?#5.52(A97) R39#1.1
A42: P?#5.53(A99) R40#1.1
A43: P?#5.54(In_X7)
A44: P?#5.55(In_X6)
A45: P?#5.56(In_X5)
A46: P?#6.58(In_X1)
A47: P?#6.59(In_X4)
A48: P?#6.61(A4) R68#1.1
A49: P?#6.62(A6) R69#1.1
A50: P?#6.63(A8) R70#1.1
A51: P?#6.66(A14) R64#1.1
A52: P?#6.67(A16) R65#1.1
A53: P?#6.68(A18) R66#1.1
A54: P?#6.71(A24) R67#1.1
A55: P?#6.72(A26) R60#1.1
A56: P?#6.73(A28) R61#1.1
A57: P?#6.76(A34) R62#1.1
A58: P?#6.77(A36) R63#1.1
A59: P?#6.78(A38) R56#1.1
A60: P?#6.81(A44) R57#1.1
A61: P?#6.82(A46) R58#1.1
A62: P?#6.83(A48) R59#1.1
A63: P?#7.86(A54) R53#1.1
A64: P?#7.86(A56) R54#1.1
A65: P?#7.87(A58) R55#1.1
A66: P?#7.91(A64) R49#1.1
A67: P?#7.92(A66) R50#1.1
A68: P?#7.93(A68) R51#1.1
A69: P?#7.96(A74) R52#1.1
A70: P?#7.97(A76) R45#1.1
A71: P?#7.98(A78) R46#1.1
A72: P?#7.101(A84) R47#1.1
A73: P?#7.102(A86) R48#1.1
A74: P?#7.103(A88) R41#1.1
A75: P?#7.106(A94) R42#1.1
A76: P?#7.107(A96) R43#1.1
A77: P?#7.108(A98) R44#1.1
A78: P?#7.110(In_X3)
A79: P?#7.111(In_X2)
B1: R89#1.2 R110.2
B2: D1.5(T2) D1.6(T1) R130.2
B3: D1.12(T3) R90#1.2
B4: D1.13(T4) R140.2
B5: D2#2.6(T1) R109.2
B6: D2#2.5(T2) R129.2
B7: D2#2.12(T3)
B8: D2#2.13(T4) R139.2
B9: D3#3.6(T1) R108.2
B10: D3#3.5(T2) R128.2
B11: D3#3.12(T3) R88#1.2
B12: D3#3.13(T4) R138.2
B13: D4#3.6(T1) R107.2
B14: D4#3.5(T2) R127.2
B15: D4#3.12(T3) R87#1.2
B16: D4#3.13(T4) R137.2
B17: D5#2.6(T1) R106.2
B18: D5#2.5(T2) R126.2
B19: D5#2.12(T3) R86#1.2
B20: D5#2.13(T4) R136.2
B21: D6#2.6(T1) R105.2
B22: D6#2.5(T2) R125.2
B23: D6#2.12(T3) R85#1.2
B24: D6#2.13(T4) R135.2
B25: D7#2.6(T1) R104.2
B26: D7#2.5(T2) R124.2
B27: D7#2.12(T3) R84#1.2
B28: D7#2.13(T4) R134.2
B29: D8#3.6(T1) R103.2
B30: D8#3.5(T2) R123.2
B31: D8#3.12(T3) R83#1.2
B32: D8#3.13(T4) R133.2
B33: D9#3.6(T1) R102.2
B34: D9#3.5(T2) R122.2
B35: D9#3.12(T3) R82#1.2
B36: D9#3.13(T4) R132.2
B37: D10#3.6(T1) R101.2
B38: D10#3.5(T2) R121.2
B39: D10#3.12(T3) R81#1.2
B40: D10#3.13(T4) R131.2
B41: D11#3.6(T1) R111.2
B42: D11#3.5(T2) R71#1.2
B43: D11#3.12(T3) R91#1.2
B44: D11#3.13(T4) R112.2
B45: D12#3.6(T1) R72#1.2
B46: D12#3.5(T2) R92#1.2
B47: D12#3.12(T3) R113.2
B48: D12#3.13(T4) R73#1.2
B49: D13#2.6(T1) R93#1.2
B50: D13#2.5(T2) R114.2
B51: D13#2.12(T3) R74#1.2
B52: D13#2.13(T4) R94#1.2
B53: D14#2.6(T1) R115.2
B54: D14#2.12(T3) R75#1.2
B55: D14#2.13(T4) R95#1.2
B56: D15#2.6(T1) R96#1.2 R116.2
B57: D15#2.5(T2) R76#1.2
B58: D15#2.12(T3)
B59: D15#2.13(T4) R117.2
B60: D16#2.6(T1) R77#1.2
B61: D16#2.5(T2) R97#1.2
B62: D16#2.12(T3) R118.2
B63: D16#2.13(T4) R78#1.2
B64: D17#2.6(T1) R98#1.2
B65: D17#2.5(T2) R119.2
B66: D17#2.12(T3) R79#1.2
B67: D17#2.13(T4) R99#1.2
B68: D18#2.5(T2) R120.2
B69: D18#2.12(T3) R80#1.2
B70: D18#2.13(T4) R100#1.2
B71: R141.2
B72: D25#1.7(D) R142.2
B73: D22#2.9(C) D23#2.9(C) D24#1.9(C) D24#1.15(D) D27#1.9(C) D27#1.15(D) D28#1.9(C) D28#1.15(D) D29#1.9(C) R143.2
B74: D19#2.7(D) R144.2
B75: D22#2.7(D) R145.2
B76: D19#2.1(C) R146.2
B77: D22#2.1(C) R147.2
B78: D19#2.9(C) D19#2.15(D) D20#2.9(C) D20#2.15(D) D21#2.9(C) D22#2.15(D) D23#2.15(D) D25#1.9(C) D25#1.15(D) D26#1.9(C) D26#1.15(D) D29#1.15(D) R148.1
X1: P?#8.14  [project net N8]
X2: P?#8.18  [project net N9]
X3: P?#8.17  [project net N10]
X4: P?#8.16  [project net N11]
X5: P?#8.1  [project net N12]
X6: P?#8.2  [project net N13]
X7: P?#8.3  [project net N14]
X8: P?#8.4
NetD1_4: D1.4(K) R2#3.2
NetD1_7: D1.7(K) R1#3.2
NetD1_11: D1.11(K) R3#3.2
NetD1_14: D1.14(K) R4#3.2
NetD2#2_4: D2#2.4(K) R6#2.2
NetD2#2_7: D2#2.7(K) R5#2.2
NetD2#2_11: D2#2.11(K) R7#1.2
NetD2#2_14: D2#2.14(K) R8#1.2
NetD3#3_4: D3#3.4(K) R10#1.2
NetD3#3_7: D3#3.7(K) R9#1.2
NetD3#3_11: D3#3.11(K) R11#1.2
NetD3#3_14: D3#3.14(K) R12#1.2
NetD4#3_4: D4#3.4(K) R14#1.2
NetD4#3_7: D4#3.7(K) R13#1.2
NetD4#3_11: D4#3.11(K) R15#1.2
NetD4#3_14: D4#3.14(K) R16#1.2
NetD5#2_4: D5#2.4(K) R18#1.2
NetD5#2_7: D5#2.7(K) R17#1.2
NetD5#2_11: D5#2.11(K) R19#1.2
NetD5#2_14: D5#2.14(K) R20#1.2
NetD6#2_4: D6#2.4(K) R22#1.2
NetD6#2_7: D6#2.7(K) R21#1.2
NetD6#2_11: D6#2.11(K) R23#1.2
NetD6#2_14: D6#2.14(K) R24#1.2
NetD7#2_4: D7#2.4(K) R26#1.2
NetD7#2_7: D7#2.7(K) R25#1.2
NetD7#2_11: D7#2.11(K) R27#1.2
NetD7#2_14: D7#2.14(K) R28#1.2
NetD8#3_4: D8#3.4(K) R30#1.2
NetD8#3_7: D8#3.7(K) R29#1.2
NetD8#3_11: D8#3.11(K) R31#1.2
NetD8#3_14: D8#3.14(K) R32#1.2
NetD9#3_4: D9#3.4(K) R34#1.2
NetD9#3_7: D9#3.7(K) R33#1.2
NetD9#3_11: D9#3.11(K) R35#1.2
NetD9#3_14: D9#3.14(K) R36#1.2
NetD10#3_4: D10#3.4(K) R38#1.2
NetD10#3_7: D10#3.7(K) R37#1.2
NetD10#3_11: D10#3.11(K) R39#1.2
NetD10#3_14: D10#3.14(K) R40#1.2
NetD11#3_4: D11#3.4(K) R43#1.2
NetD11#3_7: D11#3.7(K) R44#1.2
NetD11#3_11: D11#3.11(K) R42#1.2
NetD11#3_14: D11#3.14(K) R41#1.2
NetD12#3_4: D12#3.4(K) R47#1.2
NetD12#3_7: D12#3.7(K) R48#1.2
NetD12#3_11: D12#3.11(K) R46#1.2
NetD12#3_14: D12#3.14(K) R45#1.2
NetD13#2_4: D13#2.4(K) R51#1.2
NetD13#2_7: D13#2.7(K) R52#1.2
NetD13#2_11: D13#2.11(K) R50#1.2
NetD13#2_14: D13#2.14(K) R49#1.2
NetD14#2_7: D14#2.7(K) R55#1.2
NetD14#2_11: D14#2.11(K) R54#1.2
NetD14#2_14: D14#2.14(K) R53#1.2
NetD15#2_4: D15#2.4(K) R58#1.2
NetD15#2_7: D15#2.7(K) R59#1.2
NetD15#2_11: D15#2.11(K) R57#1.2
NetD15#2_14: D15#2.14(K) R56#1.2
NetD16#2_4: D16#2.4(K) R62#1.2
NetD16#2_7: D16#2.7(K) R63#1.2
NetD16#2_11: D16#2.11(K) R61#1.2
NetD16#2_14: D16#2.14(K) R60#1.2
NetD17#2_4: D17#2.4(K) R66#1.2
NetD17#2_7: D17#2.7(K) R67#1.2
NetD17#2_11: D17#2.11(K) R65#1.2
NetD17#2_14: D17#2.14(K) R64#1.2
NetD18#2_4: D18#2.4(K) R70#1.2
NetD18#2_11: D18#2.11(K) R69#1.2
NetD18#2_14: D18#2.14(K) R68#1.2
NetD19#2_2: D19#2.2(4) D20#2.7(D) R74#1.1
NetD19#2_3: D19#2.3 R113.1
NetD19#2_4: D19#2.4(2) R112.1
NetD19#2_5: D19#2.5(1) R111.1
NetD19#2_10: D19#2.10(4) D25#1.1(C) R114.1
NetD19#2_11: D19#2.11(3) R73#1.1
NetD19#2_12: D19#2.12(2) R72#1.1
NetD19#2_13: D19#2.13(1) R71#1.1
NetD20#2_1: D20#2.1(C) D25#1.2(4) R94#1.1
NetD20#2_2: D20#2.2(4) D21#2.7(D) R78#1.1
NetD20#2_3: D20#2.3 R97#1.1
NetD20#2_4: D20#2.4(2) R96#1.1
NetD20#2_5: D20#2.5(1) R95#1.1
NetD20#2_10: D20#2.10(4) D26#1.7(D) R98#1.1
NetD20#2_11: D20#2.11(3) R77#1.1
NetD20#2_12: D20#2.12(2) R76#1.1
NetD20#2_13: D20#2.13(1) R75#1.1
NetD21#2_12: D21#2.12(2) R80#1.1
NetD21#2_13: D21#2.13(1) R79#1.1
NetD22#2_2: D22#2.2(4) D23#2.7(D) R84#1.1
NetD22#2_3: D22#2.3 R133.1
NetD22#2_4: D22#2.4(2) R132.1
NetD22#2_5: D22#2.5(1) R131.1
NetD22#2_10: D22#2.10(4) D23#2.1(C) R134.1
NetD22#2_11: D22#2.11(3) R83#1.1
NetD22#2_12: D22#2.12(2) R82#1.1
NetD22#2_13: D22#2.13(1) R81#1.1
NetD23#2_2: D23#2.2(4) D24#1.7(D) R88#1.1
NetD23#2_3: D23#2.3 R137.1
NetD23#2_4: D23#2.4(2) R136.1
NetD23#2_5: D23#2.5(1) R135.1
NetD23#2_10: D23#2.10(4) D29#1.1(C) R138.1
NetD23#2_11: D23#2.11(3) R87#1.1
NetD23#2_12: D23#2.12(2) R86#1.1
NetD23#2_13: D23#2.13(1) R85#1.1
NetD24#1_1: D24#1.1(C) D28#1.2(4) R108.1
NetD24#1_4: D24#1.4(2) R110.1
NetD24#1_5: D24#1.5(1) R109.1
NetD24#1_12: D24#1.12(2) R90#1.1
NetD24#1_13: D24#1.13(1) R89#1.1
NetD25#1_3: D25#1.3 R117.1
NetD25#1_4: D25#1.4(2) R116.1
NetD25#1_5: D25#1.5(1) R115.1
NetD25#1_10: D25#1.10(4) D26#1.1(C) R118.1
NetD25#1_11: D25#1.11(3) R93#1.1
NetD25#1_12: D25#1.12(2) R92#1.1
NetD25#1_13: D25#1.13(1) R91#1.1
NetD26#1_4: D26#1.4(2) R120.1
NetD26#1_5: D26#1.5(1) R119.1
NetD26#1_12: D26#1.12(2) R100#1.1
NetD26#1_13: D26#1.13(1) R99#1.1
NetD27#1_2: D27#1.2(4) D28#1.7(D) R104.1
NetD27#1_3: D27#1.3 R123.1
NetD27#1_4: D27#1.4(2) R122.1
NetD27#1_5: D27#1.5(1) R121.1
NetD27#1_10: D27#1.10(4) D28#1.1(C) R124.1
NetD27#1_11: D27#1.11(3) R103.1
NetD27#1_12: D27#1.12(2) R102.1
NetD27#1_13: D27#1.13(1) R101.1
NetD28#1_3: D28#1.3 R127.1
NetD28#1_4: D28#1.4(2) R126.1
NetD28#1_5: D28#1.5(1) R125.1
NetD28#1_10: D28#1.10(4) D29#1.7(D) R128.1
NetD28#1_11: D28#1.11(3) R107.1
NetD28#1_12: D28#1.12(2) R106.1
NetD28#1_13: D28#1.13(1) R105.1
NetD29#1_4: D29#1.4(2) R140.1
NetD29#1_5: D29#1.5(1) R139.1
NetD29#1_12: D29#1.12(2) R130.1
NetD29#1_13: D29#1.13(1) R129.1

Not connected (* = marked no-connect by the designer): D14#2 4(K)* 5(T2)* 10(E)*; D18#2 6(T1)* 7(K)* 9(E)*; D21#2 1(C)* 2(4)* 3* 4(2)* 5(1)* 10(4)* 11(3)* 14(R)* 15(D)*; D24#1 2(4)* 3* 10(4)* 11(3)*; D26#1 2(4)* 3* 10(4)* 11(3)*; D27#1 1(C) 7(D); D29#1 2(4)* 3* 10(4)* 11(3)*; P?#8 15

### Notes on the sheet
- X1
- X2
- X3
- X4
- X5
- X6
- X7
- X8
- A1
- A2
- A3
- A4
- A5
- A6
- A7
- The weird ICs with "KEKEKE..." are transistor matricies (translated from the BOM on the right).
- Labels drawn without touching a wire or pin: A2
- DWG NO:
- REV:
- REVISION
- DESCRIPTION
- DATE
- APPROVED
- ENG:
- APPROVALS
- PROJECT
- DSN:
- CHK:
- REFERENCE DOCUMENTS
- PROJECT REVISION:
- TITLE
- DOCUMENT REVISION:
- DESIGN ITEM:
- BOM:
- FAB DWG:
- PCB DWG:
- ASSY DWG:
- SCALE:
- SIZE
- CAGE CODE
- FILE NAME
- DWG NO.
- SHEET
- OF
- REV

### Library data of the parts
C1#3 C2#3 C3#3 = C
D1 D2#2 D3#3 D4#3 D5#2 D6#2 D7#2 D8#3 D9#3 D10#3 D11#3 D12#3 D13#2 D14#2 D15#2 D16#2 D17#2 D18#2 = Transistor_Matrix
D19#2 D20#2 D21#2 D22#2 D23#2 D24#1 D25#1 D26#1 D27#1 D28#1 D29#1 = К561ИР2: 4-bit shift register - https://www.microshemca.ru/M.K561IR2/
P?#4 = Disp_Connector_a
P?#5 = Disp_Connector_b
P?#6 = Disp_Connector_c
P?#7 = Disp_Connector_d
P?#8 = 19x1_Connector_b
R1#3 R2#3 R3#3 R4#3 R5#2 R6#2 R7#1 R8#1 R9#1 R10#1 R11#1 R12#1 R13#1 R14#1 R15#1 R16#1 R17#1 R18#1 R19#1 R20#1 R21#1 R22#1 R23#1 R24#1 R25#1 R26#1 R27#1 R28#1 R29#1 R30#1 R31#1 R32#1 R33#1 R34#1 R35#1 R36#1 R37#1 R38#1 R39#1 R40#1 R41#1 R42#1 R43#1 R44#1 R45#1 R46#1 R47#1 R48#1 R49#1 R50#1 R51#1 R52#1 R53#1 R54#1 R55#1 R56#1 R57#1 R58#1 R59#1 R60#1 R61#1 R62#1 R63#1 R64#1 R65#1 R66#1 R67#1 R68#1 R69#1 R70#1 R71#1 R72#1 R73#1 R74#1 R75#1 R76#1 R77#1 R78#1 R79#1 R80#1 R81#1 R82#1 R83#1 R84#1 R85#1 R86#1 R87#1 R88#1 R89#1 R90#1 R91#1 R92#1 R93#1 R94#1 R95#1 R96#1 R97#1 R98#1 R99#1 R100#1 R101-R148 = R

## Sheet Cathode_Switch.SchDoc
size 594 x 420 mm; SheetNumber: 4; SheetTotal: 4
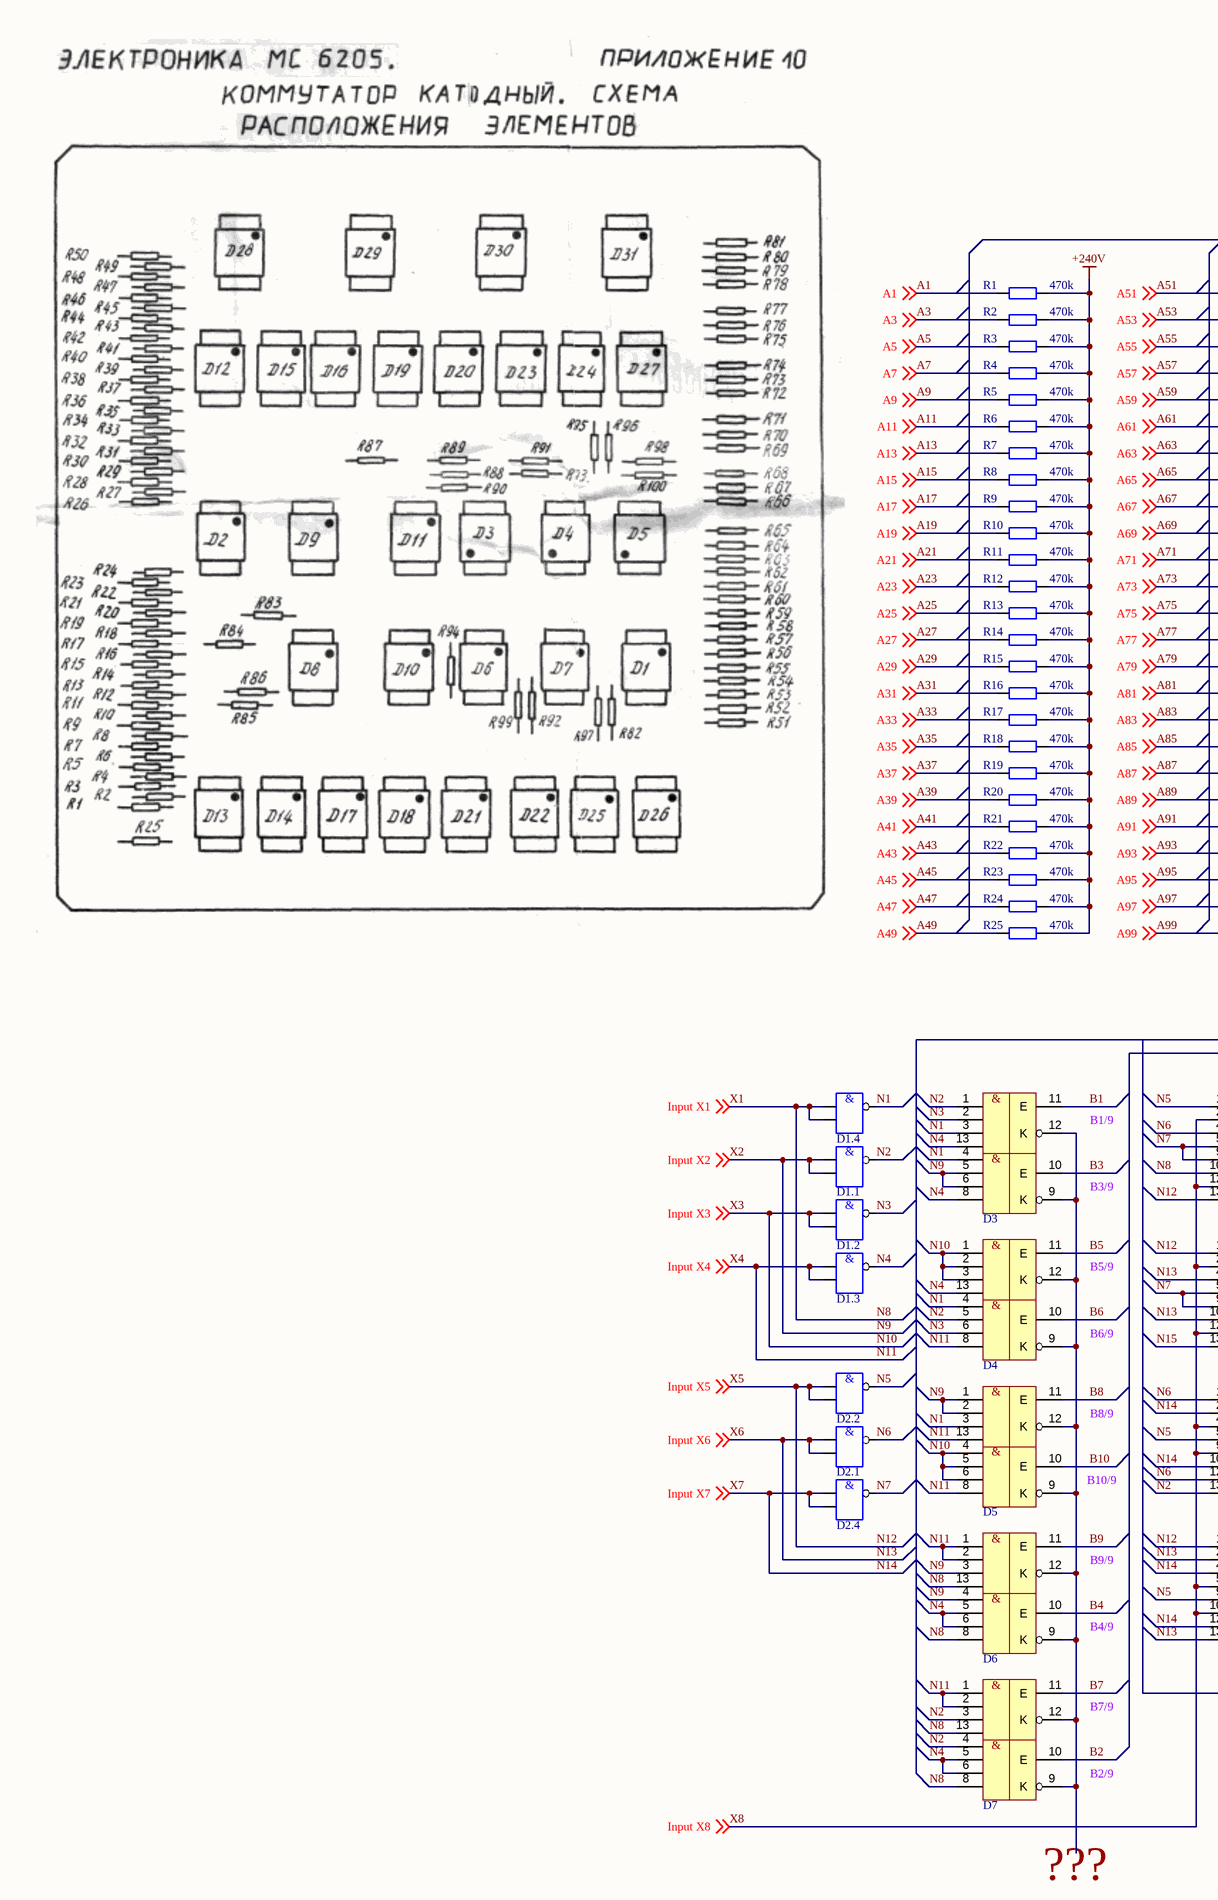
[diagram p5: Cathode_Switch.SchDoc, left]
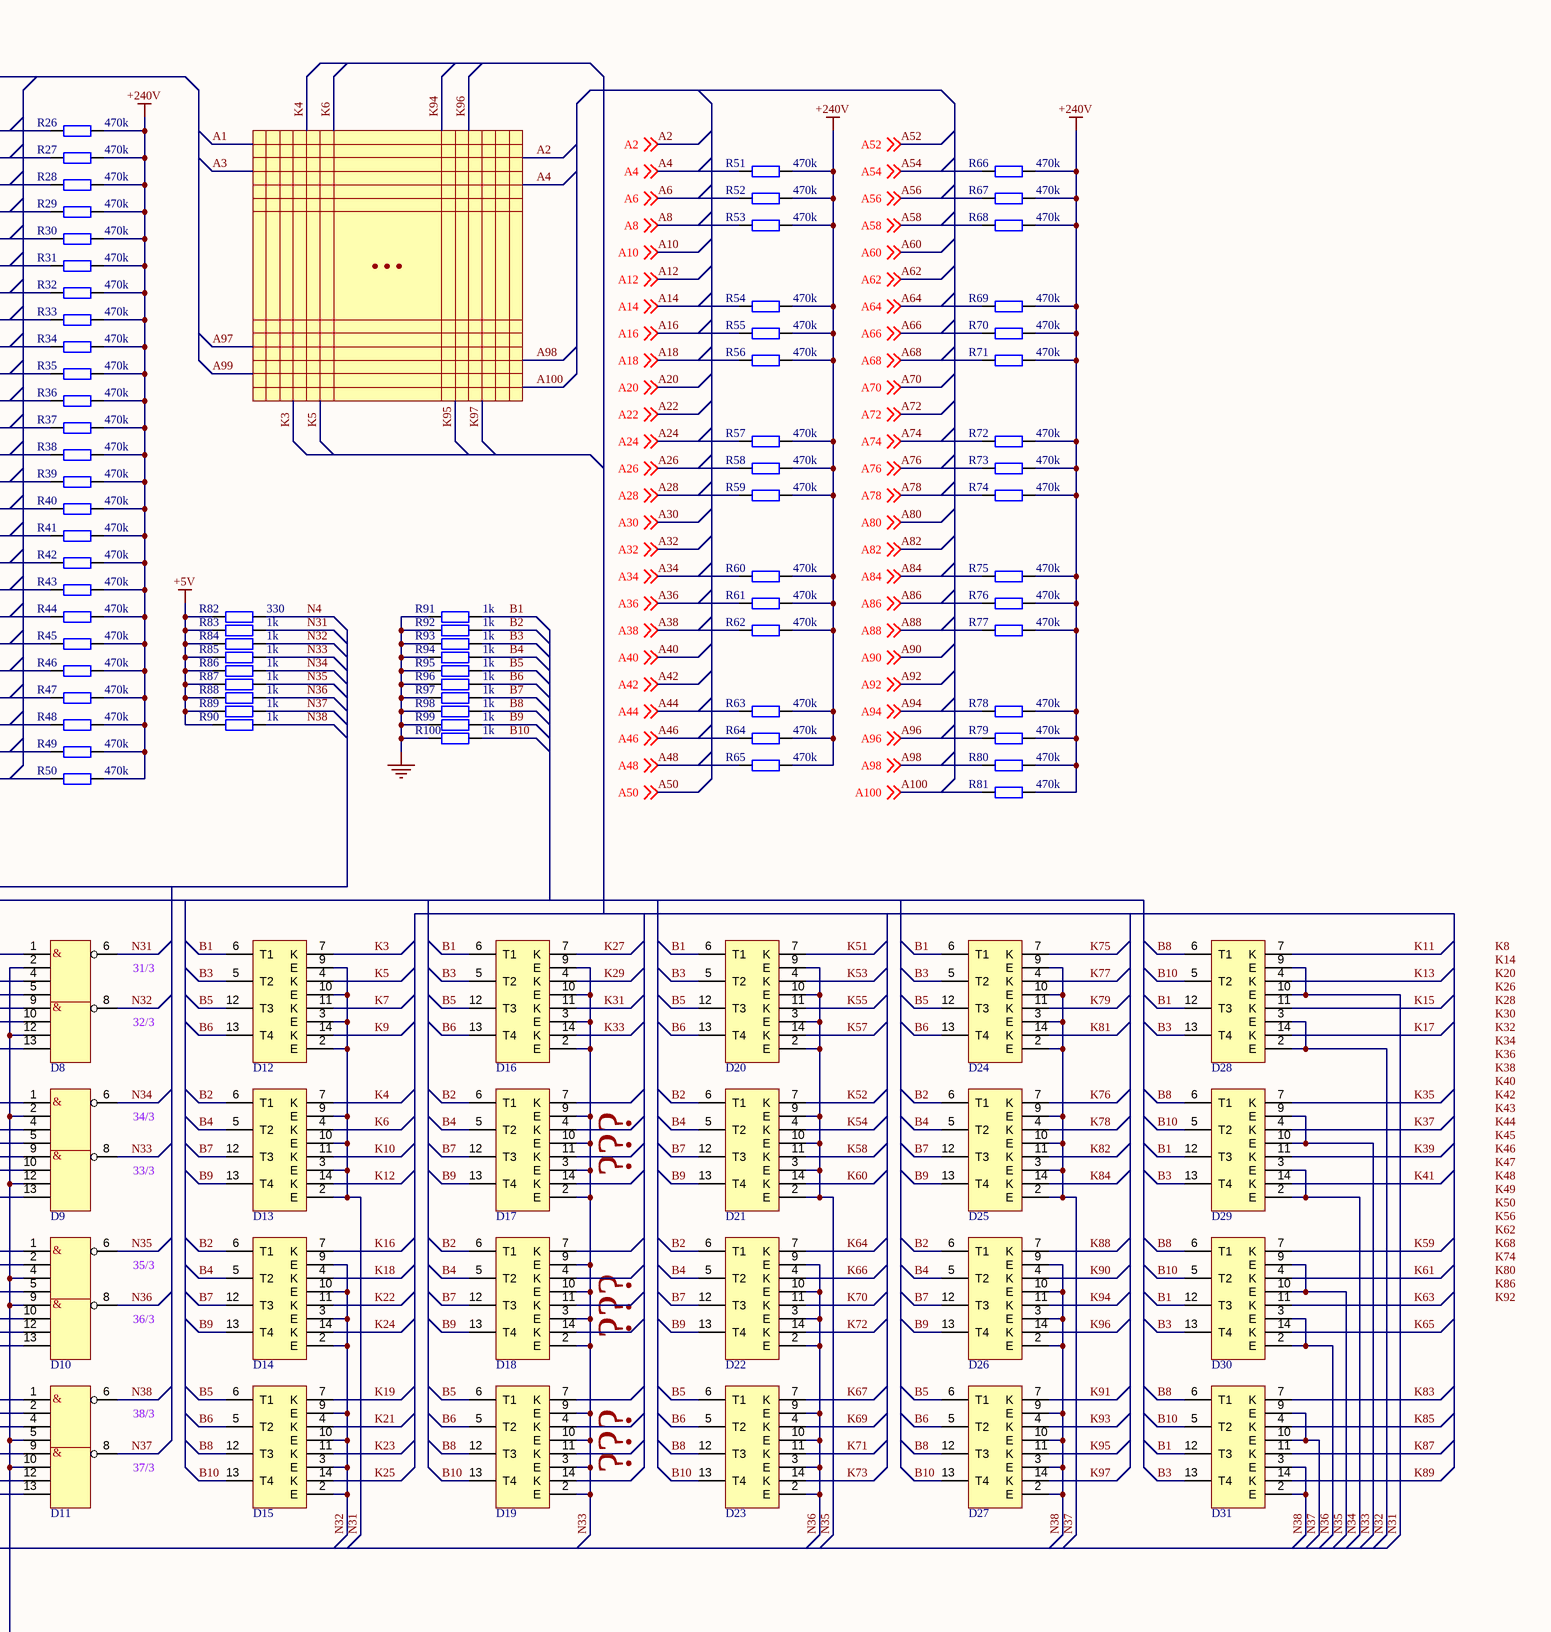
[diagram p6: Cathode_Switch.SchDoc, right]

### Parts
(Parts that share a designator on the sheet are numbered #1, #2 ... from top to bottom, then left to right.)
D1.1#3  -  (value not drawn)
D1.2#3  -  (value not drawn)
D1.3#3  -  (value not drawn)
D1.4#3  -  (value not drawn)
D2.1#2  -  (value not drawn)
D2.2#2  -  (value not drawn)
D2.4#2  -  (value not drawn)
D3#4  -  (value not drawn)
D4#4  -  (value not drawn)
D5#3  -  (value not drawn)
D6#3  -  (value not drawn)
D7#3  -  (value not drawn)
D8#4  -  (value not drawn)
D9#4  -  (value not drawn)
D10#4  -  (value not drawn)
D11#4  -  (value not drawn)
D12#4  -  (value not drawn)
D13#3  -  (value not drawn)
D14#3  -  (value not drawn)
D15#3  -  (value not drawn)
D16#3  -  (value not drawn)
D17#3  -  (value not drawn)
D18#3  -  (value not drawn)
D19#3  -  (value not drawn)
D20#3  -  (value not drawn)
D21#3  -  (value not drawn)
D22#3  -  (value not drawn)
D23#3  -  (value not drawn)
D24#2  -  (value not drawn)
D25#2  -  (value not drawn)
D26#2  -  (value not drawn)
D27#2  -  (value not drawn)
D28#2  -  (value not drawn)
D29#2  -  (value not drawn)
D30  -  (value not drawn)
D31  -  (value not drawn)
R1#4  470k
R2#4  470k
R3#4  470k
R4#4  470k
R5#3  470k
R6#3  470k
R7#2  470k
R8#2  470k
R9#2  470k
R10#2  470k
R11#2  470k
R12#2  470k
R13#2  470k
R14#2  470k
R15#2  470k
R16#2  470k
R17#2  470k
R18#2  470k
R19#2  470k
R20#2  470k
R21#2  470k
R22#2  470k
R23#2  470k
R24#2  470k
R25#2  470k
R26#2  470k
R27#2  470k
R28#2  470k
R29#2  470k
R30#2  470k
R31#2  470k
R32#2  470k
R33#2  470k
R34#2  470k
R35#2  470k
R36#2  470k
R37#2  470k
R38#2  470k
R39#2  470k
R40#2  470k
R41#2  470k
R42#2  470k
R43#2  470k
R44#2  470k
R45#2  470k
R46#2  470k
R47#2  470k
R48#2  470k
R49#2  470k
R50#2  470k
R51#2  470k
R52#2  470k
R53#2  470k
R54#2  470k
R55#2  470k
R56#2  470k
R57#2  470k
R58#2  470k
R59#2  470k
R60#2  470k
R61#2  470k
R62#2  470k
R63#2  470k
R64#2  470k
R65#2  470k
R66#2  470k
R67#2  470k
R68#2  470k
R69#2  470k
R70#2  470k
R71#2  470k
R72#2  470k
R73#2  470k
R74#2  470k
R75#2  470k
R76#2  470k
R77#2  470k
R78#2  470k
R79#2  470k
R80#2  470k
R81#2  470k
R82#2  330
R83#2  1k
R84#2  1k
R85#2  1k
R86#2  1k
R87#2  1k
R88#2  1k
R89#2  1k
R90#2  1k
R91#2  1k
R92#2  1k
R93#2  1k
R94#2  1k
R95#2  1k
R96#2  1k
R97#2  1k
R98#2  1k
R99#2  1k
R100#2  1k

### Nets
+5V: R82#2.2 R83#2.2 R84#2.2 R85#2.2 R86#2.2 R87#2.2 R88#2.2 R89#2.2 R90#2.2
+240V: R1#4.1 R2#4.1 R3#4.1 R4#4.1 R5#3.1 R6#3.1 R7#2.1 R8#2.1 R9#2.1 R10#2.1 R11#2.1 R12#2.1 R13#2.1 R14#2.1 R15#2.1 R16#2.1 R17#2.1 R18#2.1 R19#2.1 R20#2.1 R21#2.1 R22#2.1 R23#2.1 R24#2.1 R25#2.1 R26#2.1 R27#2.1 R28#2.1 R29#2.1 R30#2.1 R31#2.1 R32#2.1 R33#2.1 R34#2.1 R35#2.1 R36#2.1 R37#2.1 R38#2.1 R39#2.1 R40#2.1 R41#2.1 R42#2.1 R43#2.1 R44#2.1 R45#2.1 R46#2.1 R47#2.1 R48#2.1 R49#2.1 R50#2.1 R51#2.1 R52#2.1 R53#2.1 R54#2.1 R55#2.1 R56#2.1 R57#2.1 R58#2.1 R59#2.1 R60#2.1 R61#2.1 R62#2.1 R63#2.1 R64#2.1 R65#2.1 R66#2.1 R67#2.1 R68#2.1 R69#2.1 R70#2.1 R71#2.1 R72#2.1 R73#2.1 R74#2.1 R75#2.1 R76#2.1 R77#2.1 R78#2.1 R79#2.1 R80#2.1 R81#2.1
GND: R91#2.2 R92#2.2 R93#2.2 R94#2.2 R95#2.2 R96#2.2 R97#2.2 R98#2.2 R99#2.2 R100#2.2
A1: R1#4.2 ; off-sheet A1
A3: R2#4.2 ; off-sheet A3
A4: R51#2.2 ; off-sheet A4
A5: R3#4.2 ; off-sheet A5
A6: R52#2.2 ; off-sheet A6
A7: R4#4.2 ; off-sheet A7
A8: R53#2.2 ; off-sheet A8
A9: R5#3.2 ; off-sheet A9
A11: R6#3.2 ; off-sheet A11
A13: R7#2.2 ; off-sheet A13
A14: R54#2.2 ; off-sheet A14
A15: R8#2.2 ; off-sheet A15
A16: R55#2.2 ; off-sheet A16
A17: R9#2.2 ; off-sheet A17
A18: R56#2.2 ; off-sheet A18
A19: R10#2.2 ; off-sheet A19
A21: R11#2.2 ; off-sheet A21
A23: R12#2.2 ; off-sheet A23
A24: R57#2.2 ; off-sheet A24
A25: R13#2.2 ; off-sheet A25
A26: R58#2.2 ; off-sheet A26
A27: R14#2.2 ; off-sheet A27
A28: R59#2.2 ; off-sheet A28
A29: R15#2.2 ; off-sheet A29
A31: R16#2.2 ; off-sheet A31
A33: R17#2.2 ; off-sheet A33
A34: R60#2.2 ; off-sheet A34
A35: R18#2.2 ; off-sheet A35
A36: R61#2.2 ; off-sheet A36
A37: R19#2.2 ; off-sheet A37
A38: R62#2.2 ; off-sheet A38
A39: R20#2.2 ; off-sheet A39
A41: R21#2.2 ; off-sheet A41
A43: R22#2.2 ; off-sheet A43
A44: R63#2.2 ; off-sheet A44
A45: R23#2.2 ; off-sheet A45
A46: R64#2.2 ; off-sheet A46
A47: R24#2.2 ; off-sheet A47
A48: R65#2.2 ; off-sheet A48
A49: R25#2.2 ; off-sheet A49
A51: R26#2.2 ; off-sheet A51
A53: R27#2.2 ; off-sheet A53
A54: R66#2.2 ; off-sheet A54
A55: R28#2.2 ; off-sheet A55
A56: R67#2.2 ; off-sheet A56
A57: R29#2.2 ; off-sheet A57
A58: R68#2.2 ; off-sheet A58
A59: R30#2.2 ; off-sheet A59
A61: R31#2.2 ; off-sheet A61
A63: R32#2.2 ; off-sheet A63
A64: R69#2.2 ; off-sheet A64
A65: R33#2.2 ; off-sheet A65
A66: R70#2.2 ; off-sheet A66
A67: R34#2.2 ; off-sheet A67
A68: R71#2.2 ; off-sheet A68
A69: R35#2.2 ; off-sheet A69
A71: R36#2.2 ; off-sheet A71
A73: R37#2.2 ; off-sheet A73
A74: R72#2.2 ; off-sheet A74
A75: R38#2.2 ; off-sheet A75
A76: R73#2.2 ; off-sheet A76
A77: R39#2.2 ; off-sheet A77
A78: R74#2.2 ; off-sheet A78
A79: R40#2.2 ; off-sheet A79
A81: R41#2.2 ; off-sheet A81
A83: R42#2.2 ; off-sheet A83
A84: R75#2.2 ; off-sheet A84
A85: R43#2.2 ; off-sheet A85
A86: R76#2.2 ; off-sheet A86
A87: R44#2.2 ; off-sheet A87
A88: R77#2.2 ; off-sheet A88
A89: R45#2.2 ; off-sheet A89
A91: R46#2.2 ; off-sheet A91
A93: R47#2.2 ; off-sheet A93
A94: R78#2.2 ; off-sheet A94
A95: R48#2.2 ; off-sheet A95
A96: R79#2.2 ; off-sheet A96
A97: R49#2.2 ; off-sheet A97
A98: R80#2.2 ; off-sheet A98
A99: R50#2.2 ; off-sheet A99
A100: R81#2.2 ; off-sheet A100
B1: D3#4.11(E) D12#4.6(T1) D16#3.6(T1) D20#3.6(T1) D24#2.6(T1) D28#2.12(T3) D29#2.12(T3) D30.12(T3) D31.12(T3) R91#2.1
B2: D7#3.10(E) D13#3.6(T1) D14#3.6(T1) D17#3.6(T1) D18#3.6(T1) D21#3.6(T1) D22#3.6(T1) D25#2.6(T1) D26#2.6(T1) R92#2.1
B3: D3#4.10(E) D12#4.5(T2) D16#3.5(T2) D20#3.5(T2) D24#2.5(T2) D28#2.13(T4) D29#2.13(T4) D30.13(T4) D31.13(T4) R93#2.1
B4: D6#3.10(E) D13#3.5(T2) D14#3.5(T2) D17#3.5(T2) D18#3.5(T2) D21#3.5(T2) D22#3.5(T2) D25#2.5(T2) D26#2.5(T2) R94#2.1
B5: D4#4.11(E) D12#4.12(T3) D15#3.6(T1) D16#3.12(T3) D19#3.6(T1) D20#3.12(T3) D23#3.6(T1) D24#2.12(T3) D27#2.6(T1) R95#2.1
B6: D4#4.10(E) D12#4.13(T4) D15#3.5(T2) D16#3.13(T4) D19#3.5(T2) D20#3.13(T4) D23#3.5(T2) D24#2.13(T4) D27#2.5(T2) R96#2.1
B7: D7#3.11(E) D13#3.12(T3) D14#3.12(T3) D17#3.12(T3) D18#3.12(T3) D21#3.12(T3) D22#3.12(T3) D25#2.12(T3) D26#2.12(T3) R97#2.1
B8: D5#3.11(E) D15#3.12(T3) D19#3.12(T3) D23#3.12(T3) D27#2.12(T3) D28#2.6(T1) D29#2.6(T1) D30.6(T1) D31.6(T1) R98#2.1
B9: D6#3.11(E) D13#3.13(T4) D14#3.13(T4) D17#3.13(T4) D18#3.13(T4) D21#3.13(T4) D22#3.13(T4) D25#2.13(T4) D26#2.13(T4) R99#2.1
B10: D5#3.10(E) D15#3.13(T4) D19#3.13(T4) D23#3.13(T4) D27#2.13(T4) D28#2.5(T2) D29#2.5(T2) D30.5(T2) D31.5(T2) R100#2.1
K3: D12#4.7(K)
K4: D13#3.7(K)
K5: D12#4.4(K)
K6: D13#3.4(K)
K7: D12#4.11(K)
K9: D12#4.14(K)
K10: D13#3.11(K)
K11: D28#2.7(K)
K12: D13#3.14(K)
K13: D28#2.4(K)
K15: D28#2.11(K)
K16: D14#3.7(K)
K17: D28#2.14(K)
K18: D14#3.4(K)
K19: D15#3.7(K)
K21: D15#3.4(K)
K22: D14#3.11(K)
K23: D15#3.11(K)
K24: D14#3.14(K)
K25: D15#3.14(K)
K27: D16#3.7(K)
K29: D16#3.4(K)
K31: D16#3.11(K)
K33: D16#3.14(K)
K35: D29#2.7(K)
K37: D29#2.4(K)
K39: D29#2.11(K)
K41: D29#2.14(K)
K51: D20#3.7(K)
K52: D21#3.7(K)
K53: D20#3.4(K)
K54: D21#3.4(K)
K55: D20#3.11(K)
K57: D20#3.14(K)
K58: D21#3.11(K)
K59: D30.7(K)
K60: D21#3.14(K)
K61: D30.4(K)
K63: D30.11(K)
K64: D22#3.7(K)
K65: D30.14(K)
K66: D22#3.4(K)
K67: D23#3.7(K)
K69: D23#3.4(K)
K70: D22#3.11(K)
K71: D23#3.11(K)
K72: D22#3.14(K)
K73: D23#3.14(K)
K75: D24#2.7(K)
K76: D25#2.7(K)
K77: D24#2.4(K)
K78: D25#2.4(K)
K79: D24#2.11(K)
K81: D24#2.14(K)
K82: D25#2.11(K)
K83: D31.7(K)
K84: D25#2.14(K)
K85: D31.4(K)
K87: D31.11(K)
K88: D26#2.7(K)
K89: D31.14(K)
K90: D26#2.4(K)
K91: D27#2.7(K)
K93: D27#2.4(K)
K94: D26#2.11(K)
K95: D27#2.11(K)
K96: D26#2.14(K)
K97: D27#2.14(K)
N1: D1.4#3.3 D3#4.3(X3) D3#4.4(X5) D4#4.4(X5) D5#3.3(X3)
N2: D1.1#3.3 D3#4.1(X1) D4#4.5(X6) D7#3.3(X3) D7#3.4(X5) D10#4.13(X8)
N3: D1.2#3.3 D3#4.2(X2) D4#4.6(X7)
N4: D1.3#3.3 D3#4.8(X8) D3#4.13(X4) D4#4.13(X4) D6#3.5(X6) D6#3.6(X7) D7#3.5(X6) D7#3.6(X7) R82#2.1
N5: D2.2#2.3 D8#4.1(X1) D10#4.5(X4) D11#4.9(X5)
N6: D2.1#2.3 D8#4.4(X3) D10#4.1(X1) D10#4.12(X7)
N7: D2.4#2.3 D8#4.5(X4) D8#4.9(X5) D9#4.5(X4) D9#4.9(X5)
N8: D1.4#3.1 D1.4#3.2 D6#3.8(X8) D6#3.13(X4) D7#3.8(X8) D7#3.13(X4) D8#4.10(X6) ; off-sheet Input X1  [also labelled Input X1, X1]
N9: D1.1#3.1 D1.1#3.2 D3#4.5(X6) D3#4.6(X7) D5#3.1(X1) D5#3.2(X2) D6#3.3(X3) D6#3.4(X5) ; off-sheet Input X2  [also labelled Input X2, X2]
N10: D1.2#3.1 D1.2#3.2 D4#4.1(X1) D4#4.2(X2) D4#4.3(X3) D5#3.4(X5) D5#3.5(X6) D5#3.6(X7) ; off-sheet Input X3  [also labelled Input X3, X3]
N11: D1.3#3.1 D1.3#3.2 D4#4.8(X8) D5#3.8(X8) D5#3.13(X4) D6#3.1(X1) D6#3.2(X2) D7#3.1(X1) D7#3.2(X2) ; off-sheet Input X4  [also labelled Input X4, X4]
N12: D2.2#2.1 D2.2#2.2 D8#4.13(X8) D9#4.1(X1) D11#4.1(X1) ; off-sheet Input X5  [also labelled Input X5, X5]
N13: D2.1#2.1 D2.1#2.2 D9#4.4(X3) D9#4.10(X6) D11#4.2(X2) D11#4.13(X8) ; off-sheet Input X6  [also labelled Input X6, X6]
N14: D2.4#2.1 D2.4#2.2 D10#4.2(X2) D10#4.10(X6) D11#4.4(X3) D11#4.12(X7) ; off-sheet Input X7  [also labelled Input X7, X7]
N15: D9#4.13(X8)
N31: D8#4.6(Y1) D12#4.2(E) D12#4.3(E) D12#4.9(E) D12#4.10(E) D13#3.2(E) D13#3.3(E) D13#3.9(E) D13#3.10(E) D28#2.9(E) D28#2.10(E) R83#2.1
N32: D8#4.8(Y2) D14#3.2(E) D14#3.3(E) D14#3.9(E) D14#3.10(E) D15#3.2(E) D15#3.3(E) D15#3.9(E) D15#3.10(E) D28#2.2(E) D28#2.3(E) R84#2.1
N33: D9#4.8(Y2) D16#3.2(E) D16#3.3(E) D16#3.9(E) D16#3.10(E) D17#3.2(E) D17#3.3(E) D17#3.9(E) D17#3.10(E) D18#3.2(E) D18#3.3(E) D18#3.9(E) D18#3.10(E) D19#3.2(E) D19#3.3(E) D19#3.9(E) D19#3.10(E) D29#2.9(E) D29#2.10(E) R85#2.1
N34: D9#4.6(Y1) D29#2.2(E) D29#2.3(E) R86#2.1
N35: D10#4.6(Y1) D20#3.2(E) D20#3.3(E) D20#3.9(E) D20#3.10(E) D21#3.2(E) D21#3.3(E) D21#3.9(E) D21#3.10(E) D30.9(E) D30.10(E) R87#2.1
N36: D10#4.8(Y2) D22#3.2(E) D22#3.3(E) D22#3.9(E) D22#3.10(E) D23#3.2(E) D23#3.3(E) D23#3.9(E) D23#3.10(E) D30.2(E) D30.3(E) R88#2.1
N37: D11#4.8(Y2) D24#2.2(E) D24#2.3(E) D24#2.9(E) D24#2.10(E) D25#2.2(E) D25#2.3(E) D25#2.9(E) D25#2.10(E) D31.9(E) D31.10(E) R89#2.1
N38: D11#4.6(Y1) D26#2.2(E) D26#2.3(E) D26#2.9(E) D26#2.10(E) D27#2.2(E) D27#2.3(E) D27#2.9(E) D27#2.10(E) D31.2(E) D31.3(E) R90#2.1
X8: D8#4.2(X2) D8#4.12(X7) D9#4.2(X2) D9#4.12(X7) D10#4.4(X3) D10#4.9(X5) D11#4.5(X4) D11#4.10(X6) ; off-sheet Input X8  [also labelled Input X8]
NetD3#4_9: D3#4.9(K) D3#4.12(K) D4#4.9(K) D4#4.12(K) D5#3.9(K) D5#3.12(K) D6#3.9(K) D6#3.12(K) D7#3.9(K) D7#3.12(K)

Not connected (* = marked no-connect by the designer): D17#3 4(K) 7(K) 11(K) 14(K); D18#3 4(K) 7(K) 11(K) 14(K); D19#3 4(K) 7(K) 11(K) 14(K)

### Notes on the sheet
- ...
- B1/9
- (near D8#4) 31/3
- B3/9
- (near D8#4) 32/3
- B5/9
- (near D9#4) 34/3
- (near D9#4) 33/3
- (near D17#3) ???
- B6/9
- B8/9
- (near D10#4) 35/3
- (near D18#3) ???
- B10/9
- (near D10#4) 36/3
- B9/9
- (near D11#4) 38/3
- (near D19#3) ???
- B4/9
- (near D11#4) 37/3
- B7/9
- B2/9
- (near D7#3) ???
- Labels drawn without touching a wire or pin: K8, K14, K20, K26, K28, K30, K32, K34, K36, K38, K40, K42, K43, K44, K45, K46, K47, K48, K49, K50, K56, K62, K68, K74, K80, K86, K92
- DWG NO:
- REV:
- REVISION
- DESCRIPTION
- DATE
- APPROVED
- ENG:
- APPROVALS
- PROJECT
- DSN:
- CHK:
- REFERENCE DOCUMENTS
- PROJECT REVISION:
- TITLE
- DOCUMENT REVISION:
- DESIGN ITEM:
- BOM:
- FAB DWG:
- PCB DWG:
- ASSY DWG:
- SCALE:
- A2
- SIZE
- CAGE CODE
- FILE NAME
- DWG NO.
- SHEET
- OF
- REV
- (in symbol NAND) &
- (in symbol К133ЛА7) &
- (in symbol К133ЛД1) &

### Library data of the parts
D1.1#3 D1.2#3 D1.3#3 D1.4#3 D2.1#2 D2.2#2 D2.4#2 = NAND
D3#4 D4#4 D5#3 D6#3 D7#3 = К133ЛД1
D8#4 D9#4 D10#4 D11#4 = К133ЛА7
D12#4 D13#3 D14#3 D15#3 D16#3 D17#3 D18#3 D19#3 D20#3 D21#3 D22#3 D23#3 D24#2 D25#2 D26#2 D27#2 D28#2 D29#2 D30 D31 = Transistor_Matrix
R1#4 R2#4 R3#4 R4#4 R5#3 R6#3 R7#2 R8#2 R9#2 R10#2 R11#2 R12#2 R13#2 R14#2 R15#2 R16#2 R17#2 R18#2 R19#2 R20#2 R21#2 R22#2 R23#2 R24#2 R25#2 R26#2 R27#2 R28#2 R29#2 R30#2 R31#2 R32#2 R33#2 R34#2 R35#2 R36#2 R37#2 R38#2 R39#2 R40#2 R41#2 R42#2 R43#2 R44#2 R45#2 R46#2 R47#2 R48#2 R49#2 R50#2 R51#2 R52#2 R53#2 R54#2 R55#2 R56#2 R57#2 R58#2 R59#2 R60#2 R61#2 R62#2 R63#2 R64#2 R65#2 R66#2 R67#2 R68#2 R69#2 R70#2 R71#2 R72#2 R73#2 R74#2 R75#2 R76#2 R77#2 R78#2 R79#2 R80#2 R81#2 R82#2 R83#2 R84#2 R85#2 R86#2 R87#2 R88#2 R89#2 R90#2 R91#2 R92#2 R93#2 R94#2 R95#2 R96#2 R97#2 R98#2 R99#2 R100#2 = R